# Altium project SOM Board with RK3399.PrjPcb (part 3 of 4)

## Sheet [12]-WIFI Module WF60.SchDoc: RK3399 SOM Board Design V1.0
size A4; Author: AVIRAL MISHRA; DocumentNumber: 14; SheetNumber: 14; SheetTotal: 21; PROJECT CODE: A_V1.0
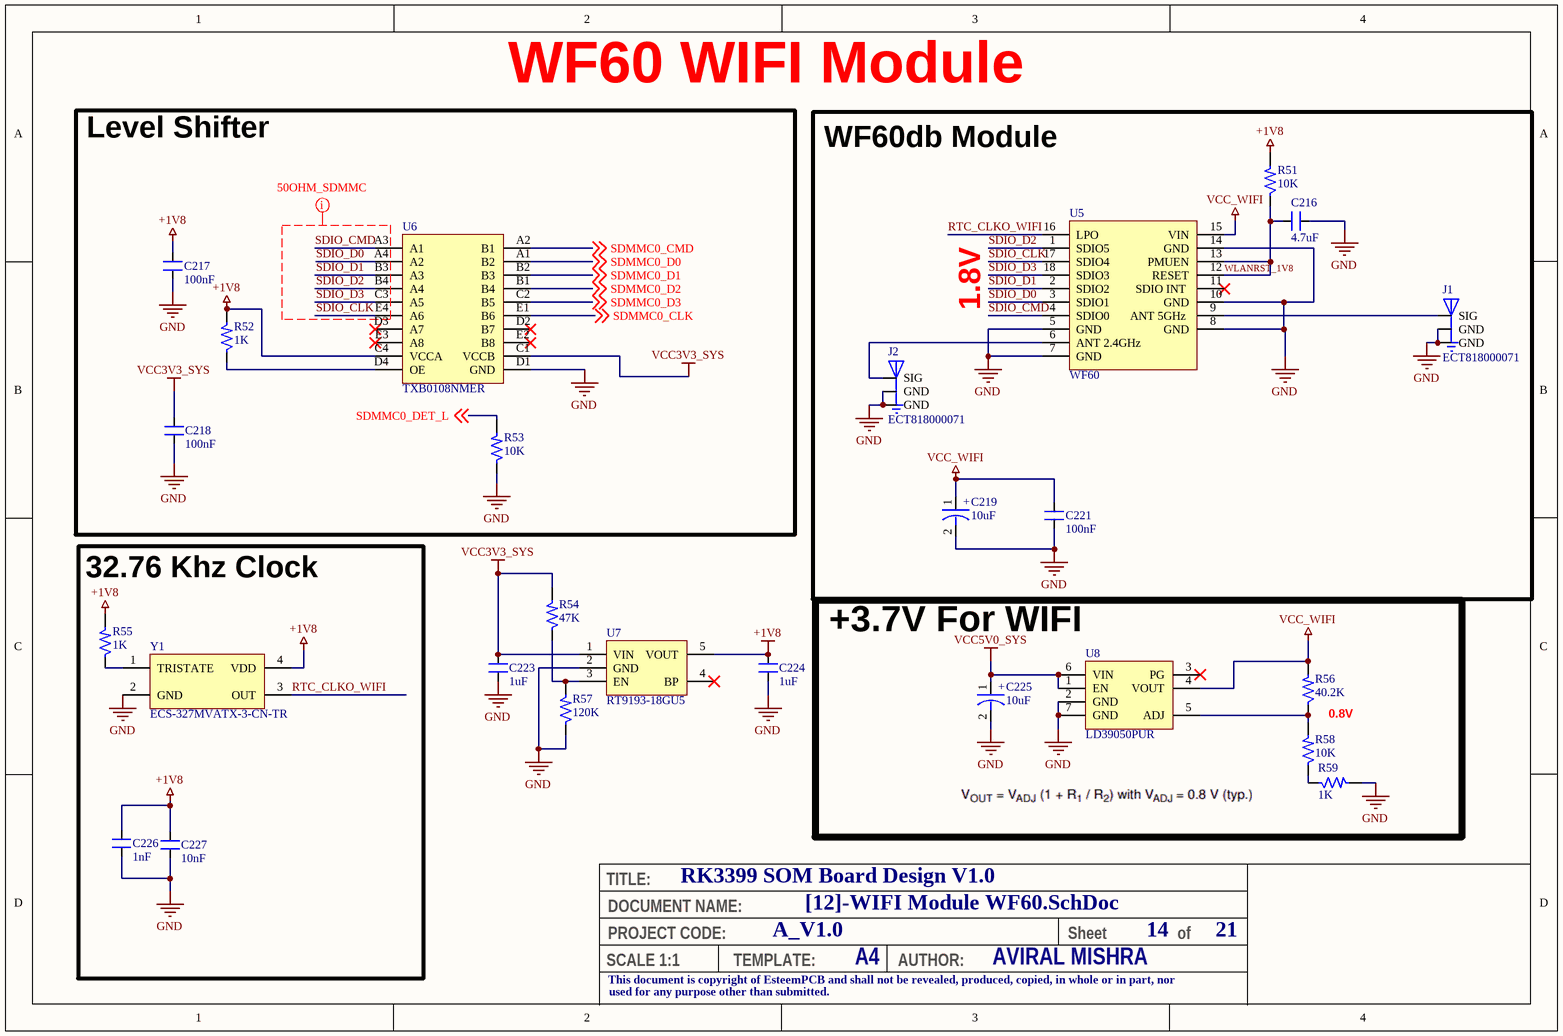
[diagram p13: [12]-WIFI Module WF60.SchDoc]

### Parts
C216  4.7uF  [CAP_0402]
C217  100nF  [CAP_0402]
C218  100nF  [CAP_0402]
C219  10uF  [CAP-T_1206]
C221  100nF  [CAP_0402]
C223  1uF  [CAP_0402]
C224  1uF  [CAP_0402]
C225  10uF  [CAP-T_1206]
C226  1nF  [CAP_0402]
C227  10nF  [CAP_0402]
J1  ECT818000071  [CON3_UFL_116_SMD_ST]
J2  ECT818000071  [CON3_UFL_116_SMD_ST]
R51  10K  [RES_0402]
R52  1K  [RES_0402]
R53  10K  [RES_0201]
R54  47K  [RES_0402]
R55  1K  [RES_0402]
R56  40.2K  [RES_0805]
R57  120K  [RES_0402]
R58  10K  [RES_0402]
R59  1K  [RES_0402]
U5  WF60  [MOD_WF60]
U6  TXB0108NMER  [NFBGA_31.4_125.9X102.36]
U7  RT9193-18GU5  [SC70-5]
U8  LD39050PUR  [DFN-6_37.4_165_33X15_SMD]
Y1  ECS-327MVATX-3-CN-TR  [XTAL_57_35X31_SMD]

### Blocks framed on the sheet
WF60 WIFI Module: C217 C218 R52 R53 U6
32.76 Khz Clock: C226 C227 R55 Y1
+3.7V For WIFI: C225 R56 R58 R59 U8

### Nets
+1V8: C217.2 C224.2 C226.2 C227.2 R51.2 R52.2 R55.2 U6.C4(VCCA) U7.5(VOUT) Y1.4(VDD)
GND: C216.1 C217.1 C218.1 C219.2 C221.1 C223.1 C224.1 C225.2 C226.1 C227.1 J1.1(GND) J1.3(GND) J2.1(GND) J2.3(GND) R53.1 R57.1 R59.2 U5.5(GND) U5.7(GND) U5.8(GND) U5.10(GND) U5.14(GND) U6.D1(GND) U7.2(GND) U8.2(GND) U8.7(GND) Y1.2(GND)
VCC3V3_SYS: C218.2 C223.2 R54.2 U6.C1(VCCB) U7.1(VIN)
VCC5V0_SYS: C225.1 U8.1(EN) U8.6(VIN)
VCC_WIFI: C219.1 C221.2 R56.2 U5.15(VIN) U8.4(VOUT)
RTC_CLKO_WIFI: U5.16(LPO) Y1.3(OUT)
SDIO_CLK: U5.17(SDIO4) U6.E4(A6)
SDIO_CMD: U5.4(SDIO0) U6.A3(A1)
SDIO_D0: U5.3(SDIO1) U6.A4(A2)
SDIO_D1: U5.2(SDIO2) U6.B3(A3)
SDIO_D2: U5.1(SDIO5) U6.B4(A4)
SDIO_D3: U5.18(SDIO3) U6.C3(A5)
SDMMC0_CLK: U6.E1(B6) ; off-sheet SDMMC0_CLK
SDMMC0_CMD: U6.A2(B1) ; off-sheet SDMMC0_CMD
SDMMC0_D0: U6.A1(B2) ; off-sheet SDMMC0_D0
SDMMC0_D1: U6.B2(B3) ; off-sheet SDMMC0_D1
SDMMC0_D2: U6.B1(B4) ; off-sheet SDMMC0_D2
SDMMC0_D3: U6.C2(B5) ; off-sheet SDMMC0_D3
SDMMC0_DET_L: R53.2 ; off-sheet SDMMC0_DET_L
WLANRST_1V8: C216.2 R51.1 U5.12(RESET) U5.13(PMUEN)
NetJ1_2: J1.2(SIG) U5.9(ANT_5GHz)
NetJ2_2: J2.2(SIG) U5.6(ANT_2.4GHz)
NetR52_1: R52.1 U6.D4(OE)
NetR54_1: R54.1 R57.2 U7.3(EN)
NetR55_1: R55.1 Y1.1(TRISTATE)
NetR56_1: R56.1 R58.2 U8.5(ADJ)
NetR58_1: R58.1 R59.1

Not connected (* = marked no-connect by the designer): U5 11(SDIO_INT_)*; U6 D2(B7)* D3(A7)* E2(B8)* E3(A8)*; U7 4(BP)*; U8 3(PG)*

### Layout directives
net class 50OHM_SDMMC: SDIO_CLK, SDIO_CMD, SDIO_D0, SDIO_D1, SDIO_D2, SDIO_D3

### Notes on the sheet
- Level Shifter
- WF60db Module
- 1.8V
- 0.8V
- TITLE:
- DOCUMENT NAME:
- SCALE 1:1
- This document is copyright of EsteemPCB and shall not be revealed, produced, copied, in whole or in part, nor
- PROJECT CODE:
- TEMPLATE:
- A4
- AUTHOR:
- Sheet
- of
- used for any purpose other than submitted.
- (in symbol CAP-P_10uF-16V-10%-1206) +

### Library data of the parts
C216 = CAP_4.7uF-10V-10%-0402: 4.7µF ±10% 10V Ceramic Capacitor X5R 0402 (1005 Metric) /; Manufacturer: Samsung Electro-Mechanics; Manufacturer Part Number: CL05A475KP5NRNC; Case/Package: 0402; Supplier-1: Digikey
C217 C218 C221 = CAP_100nF-25V-10%-0402: 0.1µF ±10% 25V Ceramic Capacitor X7R 0402 (1005 Metric) /; Manufacturer: Walsin Technology Corporation; Manufacturer Part Number: 0402B104K250CT; Case/Package: 0402; Supplier-1: Digikey
C219 C225 = CAP-P_10uF-16V-10%-1206: 10µF Molded Tantalum Capacitors 16V 1206 (3216 Metric) 3Ohm /; Manufacturer: AVX Corporation; Manufacturer Part Number: TAJA106K016SNJ; Nymble Part Number: 1EA-AA-0003; Alternate Part Number-1: CA45-A016K106T; Case/Package: 1206; Supplier-1: SIRICOM; Supplier Part Number-1: TAJA106K016SNJ; Category: Capacitor; Number of Pins: 2
C223 C224 = CAP_1uF-16V-10%-0402: 1µF ±10% 16V Ceramic Capacitor X5R 0402 (1005 Metric) /; Manufacturer: Knowles Novacap; Manufacturer Part Number: 0402BW105K160YT; Case/Package: 0402; Supplier-1: Digikey
C226 = CAP_1nF-16V-10%-0402: 1000pF ±10% 16V Ceramic Capacitor X7R 0402 (1005 Metric) /; Manufacturer: Yageo; Manufacturer Part Number: CC0402KRX7R7BB102; Case/Package: 0402; Supplier-1: Digikey
C227 = CAP_10nF-10V-10%-0402: 10000pF ±10% 10V Ceramic Capacitor X7R 0402 (1005 Metric) /; Manufacturer: AVX Corporation; Manufacturer Part Number: 0402ZC103KAT2A; Case/Package: 0402; Supplier-1: Digikey
J1 J2 = CON-PLG_3X1-ECT818000071-ST-SMD: SMD RF Connectors/Coaxial Connectors RoHS; Manufacturer: ECT; Manufacturer Part Number: ECT818000071; Case/Package: SMD; Supplier-1: LCSC
R51 R58 = RES_10K-0.1W-1%-0402: 10 kOhms ±1% 0.1W, 1/10W Chip Resistor 0402 (1005 Metric) Anti-Sulfur Thin Film /; Manufacturer: Vishay Beyschlag/Draloric/BC Components; Manufacturer Part Number: MCS04020C1002FE000; Case/Package: 0402; Supplier-1: Digikey
R52 R55 R59 = RES_1K-0.1W-1%-0402: 1 kOhms ±1% 0.1W, 1/10W Chip Resistor 0402 (1005 Metric) Anti-Sulfur Thin Film /; Manufacturer: Vishay Beyschlag/Draloric/BC Components; Manufacturer Part Number: MCS04020C1001FE000; Case/Package: 0402; Supplier-1: Digikey
R53 = RES_10K-0.05W-1%-0201: 10 kOhms ±1% 0.05W, 1/20W Chip Resistor 0201 (0603 Metric) Thick Film /; Manufacturer: Stackpole Electronics Inc; Manufacturer Part Number: RMCF0201FT10K0; Case/Package: 0201; Supplier-1: Digikey
R54 = RES_47K-0.1W-1%-0402: 47 kOhms ±1% 0.1W, 1/10W Chip Resistor 0402 (1005 Metric) Automotive AEC-Q200 Thick Film /; Manufacturer: Panasonic Electronic Components; Manufacturer Part Number: ERJ-2RKF4702X; Case/Package: 0402; Supplier-1: Digikey
R56 = RES_40.2K-0.125W-1%-0805: 40.2 kOhms ±1% 0.125W, 1/8W Chip Resistor 0805 (2012 Metric) Automotive AEC-Q200 Thick Film /; Manufacturer: TE Connectivity; Manufacturer Part Number: RMCF0805FT40K2; Nymble Part Number: 1EA-AA-0396; Alternate Part Number-1: NA; Case/Package: 0805; Supplier-1: SIRICOM; Supplier Part Number-1: WR08X4022FTL; Category: Resistor; Number of Pins: 2
R57 = RES_120K-0.1W-1%-0402: 120 kOhms ±1% 0.1W, 1/10W Chip Resistor 0402 (1005 Metric) Anti-Sulfur Thin Film /; Manufacturer: Vishay Beyschlag/Draloric/BC Components; Manufacturer Part Number: MCS04020C1203FE000; Case/Package: 0402; Supplier-1: Digikey
U5 = MOD_WF60-SMD: Amp’ed RF Tech presents the WF60 WiFi dual / band module: 802.11abgn.; Nymble Part Number: 1EA-AA-0568; Alternate Part Number-1: NA; Manufacturer: Amp’ed; Manufacturer Part Number: WF60; Case/Package: SMD; Supplier-1: Arrow; Supplier Part Number-1: WF60; Category: Module; Number of Pins: 16
U6 = IC_TXB0108NMER: Translation - Voltage Levels 8-Bit Bidirectional Voltage-Level Shifter with Auto Direction Sensing and +/-15-kV ESD Protect; Manufacturer: Texas Instruments; Manufacturer Part Number: TXB0108NMER; Case/Package: NFBGA-20; Supplier-1: Mouser
U7 = REG_1.8V-300mA-5.5V-SC70-5: Linear Voltage Regulator IC 1 Output 300mA SC-70-5; Manufacturer: Richtek USA Inc.; Manufacturer Part Number: RT9193-18GU5; Case/Package: SC70-5; Supplier-1: Digikey
U8 = REG_5.5V-0~5.1V-0.5A-2.55W-DFN-6: Adjustable 5.5V 0.8V 500mA DFN-6 Linear Voltage Regulators RoHS; Manufacturer: STMicroelectronics; Nymble Part Number: 1EA-AA-0572; Alternate Part Number-1: NA; Manufacturer Part Number: LD39050PUR; Case/Package: DFN-6; Supplier-1: LCSC; Supplier Part Number-1: C222094; Category: Regulators; Number of Pins: 6
Y1 = XTAL_ECS-327MVATX-2-CN-TR: 32.768kHz XO (Standard) CMOS Oscillator 1.6V ~ 3.6V Enable/Disable 4-SMD, No Lead; Manufacturer: ECS INC; Nymble Part Number: 1EA-AA-0561; Alternate Part Number-1: NA; Manufacturer Part Number: ECS-327MVATX-3-CN-TR; Case/Package: SMD-4; Supplier-1: Digikey; Supplier Part Number-1: ECS-327MVATX-3-CN-TR; Category: Crystal; Number of Pins: 4

## Sheet [13]-TYPEC0_PROG.SchDoc: RK3399 SOM Board Design V1.0
size A3; Author: ABC; Organization: Altium Limited; Address1: L3, 12a Rodborough Rd; Address2: Frenchs Forest; Address3: NSW; Address4: Australia 2086; DocumentNumber: 15; SheetNumber: 15; SheetTotal: 21; PROJECT CODE: A_V1.0
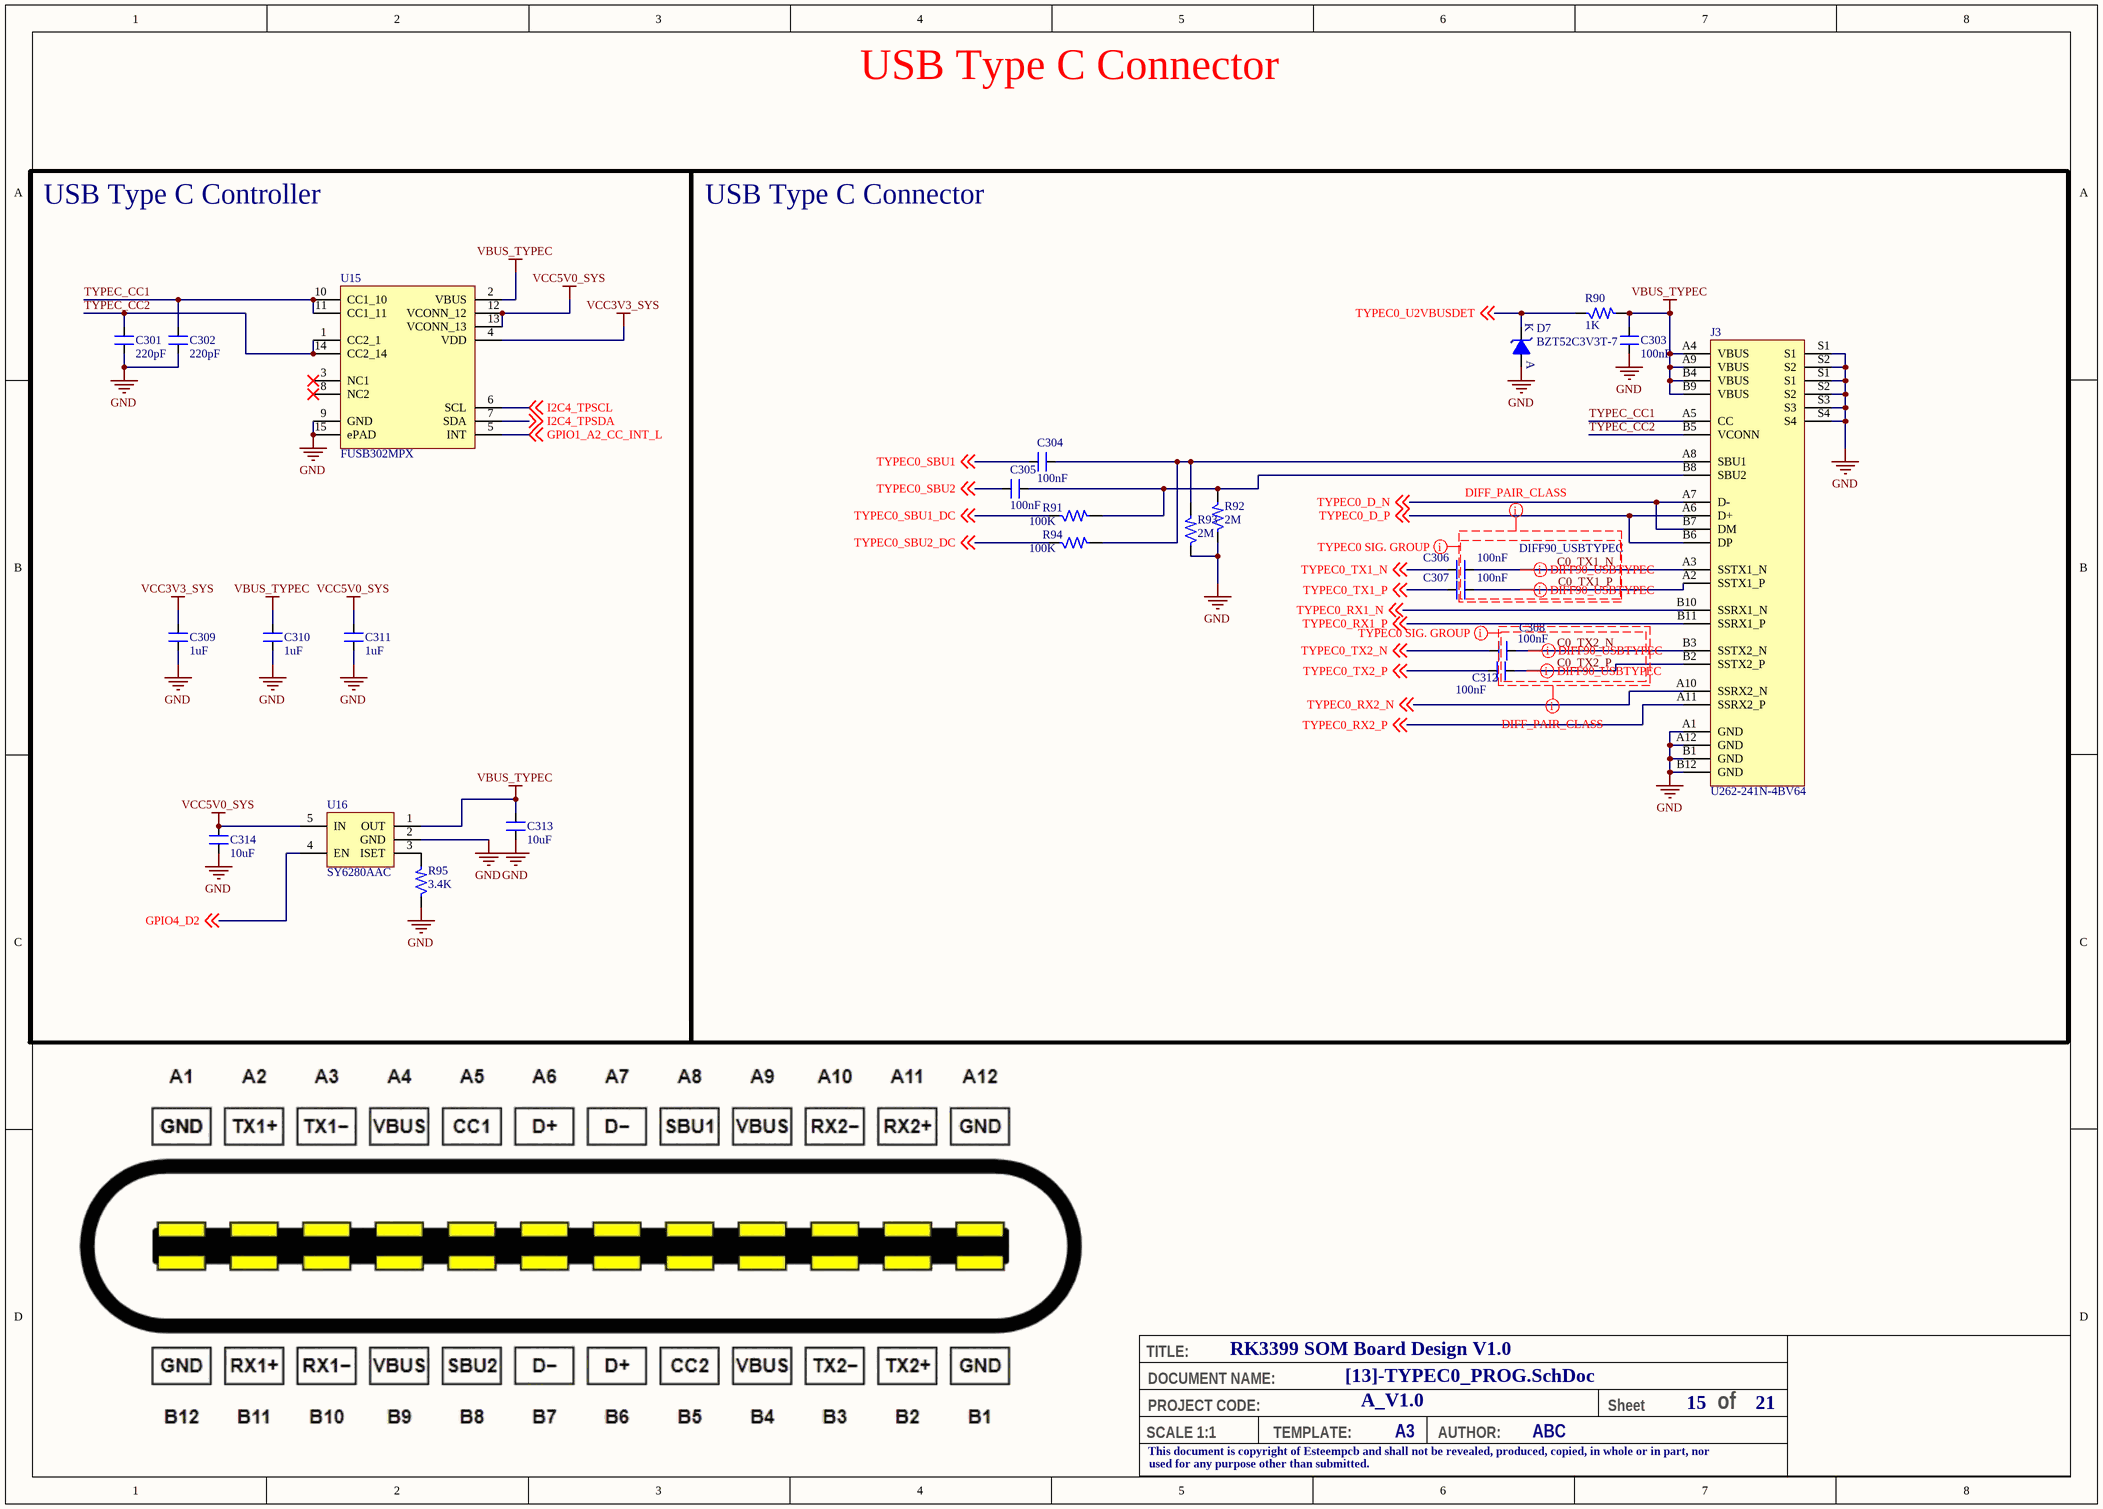
[diagram p14: [13]-TYPEC0_PROG.SchDoc]

### Parts
C301  220pF  [CAP_0402]
C302  220pF  [CAP_0402]
C303  100nF  [CAP_0603]
C304  100nF  [CAP_0402]
C305  100nF  [CAP_0402]
C306  100nF  [CAP_0402]
C307  100nF  [CAP_0402]
C308  100nF  [CAP_0402]
C309  1uF  [CAP_0402]
C310  1uF  [CAP_0402]
C311  1uF  [CAP_0402]
C312  100nF  [CAP_0402]
C313  10uF  [CAP_0402]
C314  10uF  [CAP_0402]
D7  BZT52C3V3T-7  [DIO_SOD523]
J3  U262-241N-4BV64  [CON24_19.64_U262-241N-4BV64_TH_RA]
R90  1K  [RES_0402]
R91  100K  [RES_0402]
R92  2M  [RES_0402]
R93  2M  [RES_0402]
R94  100K  [RES_0402]
R95  3.4K  [RES_0402]
U15  FUSB302MPX  [MLP-14_98.4X98.4_SMD]
U16  SY6280AAC  [SOT23-5]

### Blocks framed on the sheet
USB Type C Controller: C301 C302 C309-C311 C313 C314 R95 U15 U16
USB Type C Connector: C303-C308 C312 D7 J3 R90-R94

### Nets
GND: C301.1 C302.1 C303.1 C309.1 C310.1 C311.1 C313.1 C314.1 D7.A J3.A1(GND) J3.A12(GND) J3.B1(GND) J3.B12(GND) J3.S1 J3.S2 J3.S3 J3.S4 R92.1 R93.1 R95.1 U15.9(GND) U15.15(ePAD) U16.2(GND)
VBUS_TYPEC: C303.2 C310.2 C313.2 J3.A4(VBUS) J3.A9(VBUS) J3.B4(VBUS) J3.B9(VBUS) R90.2 U15.2(VBUS) U16.1(OUT)
VCC3V3_SYS: C309.2 U15.4(VDD)
VCC5V0_SYS: C311.2 C314.2 U15.12(VCONN_12) U15.13(VCONN_13) U16.5(IN)
C0_TX1_N: C306.2 J3.A3(SSTX1_N)
C0_TX1_P: C307.2 J3.A2(SSTX1_P)
C0_TX2_N: C308.2 J3.B3(SSTX2_N)
C0_TX2_P: C312.2 J3.B2(SSTX2_P)
GPIO1_A2_CC_INT_L: U15.5(INT) ; off-sheet GPIO1_A2_CC_INT_L
GPIO4_D2: U16.4(EN) ; off-sheet GPIO4_D2
I2C4_TPSCL: U15.6(SCL) ; off-sheet I2C4_TPSCL
I2C4_TPSDA: U15.7(SDA) ; off-sheet I2C4_TPSDA
TYPEC0_D_N: J3.A7(D-) J3.B7(DM) ; off-sheet TYPEC0_D_N
TYPEC0_D_P: J3.A6(D+) J3.B6(DP) ; off-sheet TYPEC0_D_P
TYPEC0_RX1_N: J3.B10(SSRX1_N) ; off-sheet TYPEC0_RX1_N
TYPEC0_RX1_P: J3.B11(SSRX1_P) ; off-sheet TYPEC0_RX1_P
TYPEC0_RX2_N: J3.A10(SSRX2_N) ; off-sheet TYPEC0_RX2_N
TYPEC0_RX2_P: J3.A11(SSRX2_P) ; off-sheet TYPEC0_RX2_P
TYPEC0_SBU1: C304.1 ; off-sheet TYPEC0_SBU1
TYPEC0_SBU1_DC: R91.1 ; off-sheet TYPEC0_SBU1_DC
TYPEC0_SBU2: C305.1 ; off-sheet TYPEC0_SBU2
TYPEC0_SBU2_DC: R94.1 ; off-sheet TYPEC0_SBU2_DC
TYPEC0_TX1_N: C306.1 ; off-sheet TYPEC0_TX1_N
TYPEC0_TX1_P: C307.1 ; off-sheet TYPEC0_TX1_P
TYPEC0_TX2_N: C308.1 ; off-sheet TYPEC0_TX2_N
TYPEC0_TX2_P: C312.1 ; off-sheet TYPEC0_TX2_P
TYPEC0_U2VBUSDET: D7.K R90.1 ; off-sheet TYPEC0_U2VBUSDET
TYPEC_CC1: C302.2 J3.A5(CC) U15.10(CC1_10) U15.11(CC1_11)
TYPEC_CC2: C301.2 J3.B5(VCONN) U15.1(CC2_1) U15.14(CC2_14)
NetC304_2: C304.2 J3.A8(SBU1) R93.2 R94.2
NetC305_2: C305.2 J3.B8(SBU2) R91.2 R92.2
NetR95_2: R95.2 U16.3(ISET)

Not connected (* = marked no-connect by the designer): U15 3(NC1)* 8(NC2)*

### Layout directives
net class TYPEC0 SIG. GROUP: C0_TX1_N, C0_TX1_P, C0_TX2_N, C0_TX2_P
differential pair; differential pair class DIFF90_USBTYPEC: C0_TX1_N, C0_TX1_P, C0_TX2_N, C0_TX2_P
net class DIFF_PAIR_CLASS: C0_TX1_N, C0_TX1_P, C0_TX2_N, C0_TX2_P

### Notes on the sheet
- USB Type C Connector
- TITLE:
- DOCUMENT NAME:
- SCALE 1:1
- This document is copyright of Esteempcb and shall not be revealed, produced, copied, in whole or in part, nor
- PROJECT CODE:
- TEMPLATE:
- A3
- AUTHOR:
- Sheet
- of
- used for any purpose other than submitted.

### Library data of the parts
C301 C302 = CAP_220pF-10V-10%-0402: 220pF ±10% 10V Ceramic Capacitor X7R 0402 (1005 Metric) /; Manufacturer: KEMET; Manufacturer Part Number: C0402C221K8RAC7867; Case/Package: 0402; Supplier-1: Digikey
C303 = CAP_100nF-10V-5%-0603: 0.1µF ±10% 10V Ceramic Capacitor X7R 0603 (1608 Metric) /; Manufacturer: Yageo; Manufacturer Part Number: CC0603KRX7R6BB104; Case/Package: 0603; Supplier-1: Digikey
C304-C308 C312 = CAP_100nF-25V-10%-0402: as C217 on sheet [12]-WIFI Module WF60; Case/Package: 0402; Supplier-1: Digikey
C309-C311 = CAP_1uF-10V-10%-0402: 1µF ±10% 10V Ceramic Capacitor X6S 0402 (1005 Metric) /; Manufacturer: Murata Electronics; Manufacturer Part Number: GRT155C81A105KE01D; Case/Package: 0402; Supplier-1: Digikey
C313 C314 = CAP_10uF-10V-20%-0402: as C101 on sheet [8]-RK3399 SDRAM Page; Case/Package: 0402; Supplier-1: Digikey
D7 = DIO-Z_3.3V-300mW-SOD-523: Zener Diode 3.3V 300mW ±6% Surface Mount SOD-523 /; Manufacturer: Diodes Incorporated; Manufacturer Part Number: BZT52C3V3T-7; Case/Package: SOD523; Supplier-1: Digikey
J3 = CON-TYPEC_U262-241N-4BV64-SMD: USB - Type C Female 24 SMD USB Connectors RoHS; Manufacturer: XKB Connectivity; Manufacturer Part Number: U262-241N-4BV64; Case/Package: SMD; Supplier-1: LCSC
R90 = RES_1K-0.1W-1%-0402: as R52 on sheet [12]-WIFI Module WF60; Case/Package: 0402; Supplier-1: Digikey
R91 R94 = RES_100K-0.1W-1%-0402: 100 kOhms ±1% 0.1W, 1/10W Chip Resistor 0402 (1005 Metric) Anti-Sulfur Thin Film /; Manufacturer: Vishay Beyschlag/Draloric/BC Components; Manufacturer Part Number: MCS04020C1003FE000; Case/Package: 0402; Supplier-1: Digikey
R92 R93 = RES_2M-0.1W-1%-0402: 2 MOhms ±1% 0.1W, 1/10W Chip Resistor 0402 (1005 Metric) Anti-Sulfur Thin Film /; Manufacturer: Vishay Beyschlag/Draloric/BC Components; Manufacturer Part Number: MCS04020C2004FE000; Case/Package: 0402; Supplier-1: Digikey
R95 = RES_3.4K-0.1W-1%-0402: 3.4 kOhms ±1% 0.1W, 1/10W Chip Resistor 0402 (1005 Metric) Automotive AEC-Q200 Thick Film /; Manufacturer: Panasonic Electronic Components; Manufacturer Part Number: ERJ-2RKF3401X; Case/Package: 0402; Supplier-1: Digikey
U15 = IC_FUSB302MPX: USB Controller USB 3.1 USB Interface 14-MLP (2.5x2.5); Manufacturer: ON Semiconductor; Manufacturer Part Number: FUSB302MPX; Case/Package: 14-MLP; Supplier-1: Digikey
U16 = REG-ADJ_5.5V-5.5V-1.25A-SOT-23-5: SOT-23-5 PMIC - Power Distribution Switches RoHS; Manufacturer: Silergy Corp; Manufacturer Part Number: SY6280AAC; Case/Package: SOT-23-5; Supplier-1: LCSC

## Sheet [14]-RGMII_PHY.SchDoc: RK3399 SOM Board Design V1.0
size A3; Author: ABC; Organization: Altium Limited; Address1: L3, 12a Rodborough Rd; Address2: Frenchs Forest; Address3: NSW; Address4: Australia 2086; DocumentNumber: 16; SheetNumber: 16; SheetTotal: 21; PROJECT CODE: A_V1.0
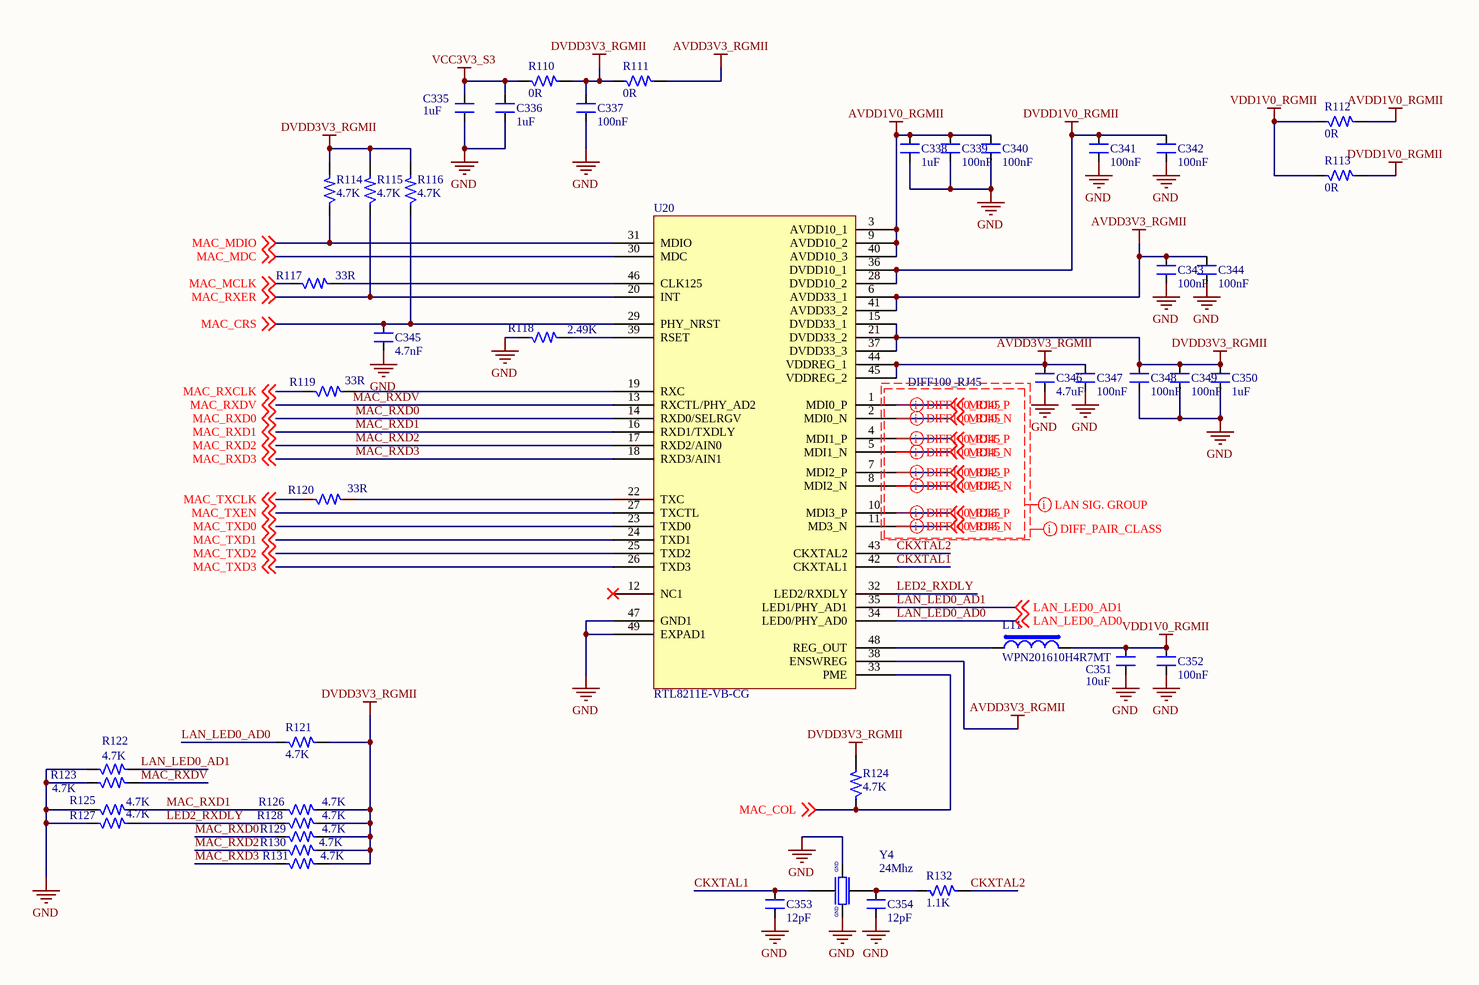
[diagram p15: [14]-RGMII_PHY.SchDoc]

### Parts
C335  1uF  [CAP_0201]
C336  1uF  [CAP_0201]
C337  100nF  [CAP_0201]
C338  1uF  [CAP_0201]
C339  100nF  [CAP_0201]
C340  100nF  [CAP_0201]
C341  100nF  [CAP_0201]
C342  100nF  [CAP_0201]
C343  100nF  [CAP_0201]
C344  100nF  [CAP_0201]
C345  4.7nF  [CAP_0201]
C346  4.7uF  [CAP_0201]
C347  100nF  [CAP_0201]
C348  100nF  [CAP_0201]
C349  100nF  [CAP_0201]
C350  1uF  [CAP_0603]
C351  10uF  [CAP_0402]
C352  100nF  [CAP_0201]
C353  12pF  [CAP_0201]
C354  12pF  [CAP_0201]
L11  WPN201610H4R7MT  [IND_62.9_110X86.6_SMD]
R110  0R  [RES_0201]
R111  0R  [RES_0201]
R112  0R  [RES_0201]
R113  0R  [RES_0201]
R114  4.7K  [RES_0201]
R115  4.7K  [RES_0201]
R116  4.7K  [RES_0201]
R117  33R  [RES_0201]
R118  2.49K  [RES_0201]
R119  33R  [RES_0201]
R120  33R  [RES_0201]
R121  4.7K  [RES_0201]
R122  4.7K  [RES_0201]
R123  4.7K  [RES_0201]
R124  4.7K  [RES_0201]
R125  4.7K  [RES_0201]
R126  4.7K  [RES_0201]
R127  4.7K  [RES_0201]
R128  4.7K  [RES_0201]
R129  4.7K  [RES_0201]
R130  4.7K  [RES_0201]
R131  4.7K  [RES_0201]
R132  1.1K  [RES_0201]
U20  RTL8211E-VB-CG  [QFN48_19.6_324X324_SMD]
Y4  24Mhz  [XTAL_ABM8AIG-24.000MHZ-12-2Z-T3]

### Nets
AVDD1V0_RGMII: C338.2 C339.2 C340.2 R112.2 U20.3(AVDD10_1) U20.9(AVDD10_2) U20.40(AVDD10_3)
AVDD3V3_RGMII: C343.2 C344.2 C346.2 C347.2 R111.2 U20.6(AVDD33_1) U20.38(ENSWREG) U20.41(AVDD33_2) U20.44(VDDREG_1) U20.45(VDDREG_2)
DVDD1V0_RGMII: C341.2 C342.2 R113.2 U20.28(DVDD10_2) U20.36(DVDD10_1)
DVDD3V3_RGMII: C337.2 C348.2 C349.2 C350.2 R110.2 R111.1 R114.2 R115.2 R116.2 R121.2 R124.2 R126.2 R128.2 R129.2 R130.2 R131.2 U20.15(DVDD33_1) U20.21(DVDD33_2) U20.37(DVDD33_3)
GND: C335.1 C336.1 C337.1 C338.1 C339.1 C340.1 C341.1 C342.1 C343.1 C344.1 C345.1 C346.1 C347.1 C348.1 C349.1 C350.1 C351.1 C352.1 C353.1 C354.1 R118.1 R122.1 R123.1 R125.1 R127.1 U20.47(GND1) U20.49(EXPAD1) Y4.2 Y4.4
VCC3V3_S3: C335.2 C336.2 R110.1
VDD1V0_RGMII: C351.2 C352.2 L11.2 R112.1 R113.1
CKXTAL1: C353.2 U20.42(CKXTAL1) Y4.1
CKXTAL2: R132.2 U20.43(CKXTAL2)
LAN_LED0_AD0: R121.1 U20.34(LED0/PHY_AD0) ; off-sheet LAN_LED0_AD0
LAN_LED0_AD1: R122.2 U20.35(LED1/PHY_AD1) ; off-sheet LAN_LED0_AD1
LED2_RXDLY: R127.2 R128.1 U20.32(LED2/RXDLY)
MAC_COL: R124.1 U20.33(PME) ; off-sheet MAC_COL
MAC_CRS: C345.2 R116.1 U20.29(PHY_NRST) ; off-sheet MAC_CRS
MAC_MCLK: R117.1 ; off-sheet MAC_MCLK
MAC_MDC: U20.30(MDC) ; off-sheet MAC_MDC
MAC_MDIO: R114.1 U20.31(MDIO) ; off-sheet MAC_MDIO
MAC_RXCLK: R119.1 ; off-sheet MAC_RXCLK
MAC_RXD0: R129.1 U20.14(RXD0/SELRGV) ; off-sheet MAC_RXD0
MAC_RXD1: R125.2 R126.1 U20.16(RXD1/TXDLY) ; off-sheet MAC_RXD1
MAC_RXD2: R130.1 U20.17(RXD2/AIN0) ; off-sheet MAC_RXD2
MAC_RXD3: R131.1 U20.18(RXD3/AIN1) ; off-sheet MAC_RXD3
MAC_RXDV: R123.2 U20.13(RXCTL/PHY_AD2) ; off-sheet MAC_RXDV
MAC_RXER: R115.1 U20.20(INT) ; off-sheet MAC_RXER
MAC_TXCLK: R120.1 ; off-sheet MAC_TXCLK
MAC_TXD0: U20.23(TXD0) ; off-sheet MAC_TXD0
MAC_TXD1: U20.24(TXD1) ; off-sheet MAC_TXD1
MAC_TXD2: U20.25(TXD2) ; off-sheet MAC_TXD2
MAC_TXD3: U20.26(TXD3) ; off-sheet MAC_TXD3
MAC_TXEN: U20.27(TXCTL) ; off-sheet MAC_TXEN
MDI0_N: U20.2(MDI0_N) ; off-sheet MDI0_N
MDI0_P: U20.1(MDI0_P) ; off-sheet MDI0_P
MDI1_N: U20.5(MDI1_N) ; off-sheet MDI1_N
MDI1_P: U20.4(MDI1_P) ; off-sheet MDI1_P
MDI2_N: U20.8(MDI2_N) ; off-sheet MDI2_N
MDI2_P: U20.7(MDI2_P) ; off-sheet MDI2_P
MDI3_N: U20.11(MD3_N) ; off-sheet MDI3_N
MDI3_P: U20.10(MDI3_P) ; off-sheet MDI3_P
NetC354_2: C354.2 R132.1 Y4.3
NetL11_1: L11.1 U20.48(REG_OUT)
NetR117_2: R117.2 U20.46(CLK125)
NetR118_2: R118.2 U20.39(RSET)
NetR119_2: R119.2 U20.19(RXC)
NetR120_2: R120.2 U20.22(TXC)

Not connected (* = marked no-connect by the designer): U20 12(NC1)*

### Layout directives
differential pair; differential pair class DIFF100_RJ45: MDI0_N, MDI0_P, MDI1_N, MDI1_P, MDI2_N, MDI2_P, MDI3_N, MDI3_P
net class LAN SIG. GROUP: MDI0_N, MDI0_P, MDI1_N, MDI1_P, MDI2_N, MDI2_P, MDI3_N, MDI3_P
net class DIFF_PAIR_CLASS: MDI0_N, MDI0_P, MDI1_N, MDI1_P, MDI2_N, MDI2_P, MDI3_N, MDI3_P

### Notes on the sheet
- TITLE:
- DOCUMENT NAME:
- SCALE 1:1
- This document is copyright of Esteempcb and shall not be revealed, produced, copied, in whole or in part, nor
- PROJECT CODE:
- TEMPLATE:
- A3
- AUTHOR:
- Sheet
- of
- used for any purpose other than submitted.
- (in symbol XTAL_24Mhz-12pF-4-SMD) GND

### Library data of the parts
C335 C336 C338 = CAP_1uF-16V-10%-0201: 1µF ±20% 16V Ceramic Capacitor X5R 0201 (0603 Metric) /; Manufacturer: Samsung Electro-Mechanics; Manufacturer Part Number: CL03A105MO3NRNH; Case/Package: 0201; Supplier-1: Digikey
C337 C339-C344 C347-C349 C352 = CAP_100nF-25V-10%-0201: 0.1µF ±10% 25V Ceramic Capacitor X5R 0201 (0603 Metric) /; Manufacturer: TDK Corporation; Manufacturer Part Number: C0603X5R1E104K030BB; Case/Package: 0201; Supplier-1: Digikey
C345 = CAP_4.7nF-10V-10%-0201: 4700pF ±10% 10V Ceramic Capacitor X7R 0201 (0603 Metric) /; Manufacturer: AVX Corporation; Manufacturer Part Number: 0201ZC472KAT2A; Case/Package: 0201; Supplier-1: Digikey
C346 = CAP_4.7uF-6.3V-20%-0201: 4.7µF ±20% 6.3V Ceramic Capacitor X5R 0201 (0603 Metric) /; Manufacturer: Murata Electronics; Manufacturer Part Number: GRM035R60J475ME15D; Case/Package: 0201; Supplier-1: Digikey
C350 = CAP_1uF-10V-5%-0603: 1µF ±10% 10V Ceramic Capacitor X5R 0603 (1608 Metric) /; Manufacturer: Samsung Electro-Mechanics; Manufacturer Part Number: CL10A105KP8NNNC; Case/Package: 0603; Supplier-1: Digikey
C351 = CAP_10uF-10V-20%-0402: 10µF ±20% 10V Ceramic Capacitor X5R 0402 (1005 Metric) /; Manufacturer Part Number: CL05A106MP5NUNC; Manufacturer: Samsung Electro-Mechanics; Case/Package: 0402; Supplier-1: Digikey
C353 C354 = CAP_12pF-16V-10%-0201: 12pF ±10% 16V Ceramic Capacitor C0G, NP0 0201 (0603 Metric) /; Manufacturer: AVX Corporation; Manufacturer Part Number: 0201YA120KAT2A; Case/Package: 0201; Supplier-1: Digikey
L11 = IND_4.7uH-0.9A-20%-SMD: 4.7uH ±20% 900mA 425mΩ SMD,2.0x1.6x1.0mm Power Inductors RoHS /; Manufacturer: Sunlord; Manufacturer Part Number: WPN201610H4R7MT; Case/Package: SMD; Supplier-1: LCSC
R110-R113 = RES_0R-0.05W-1%-0201: 0 Ohms Jumper 0.05W, 1/20W Chip Resistor 0201 (0603 Metric) Automotive AEC-Q200 Thick Film; Manufacturer: Bourns Inc.; Manufacturer Part Number: CR0201AJ/-000GLF; Case/Package: 0201; Supplier-1: Digikey
R114-R116 R121-R131 = RES_4.7K-0.1W-1%-0201: 4.02 kOhms ±1% 0.05W, 1/20W Chip Resistor 0201 (0603 Metric) Thick Film /; Manufacturer: Yageo; Manufacturer Part Number: RC0201FR-074K02L; Case/Package: 0201; Supplier-1: Digikey
R117 R119 R120 = RES_33R-0.05W-1%-0201: 33 Ohms ±1% 0.05W, 1/20W Chip Resistor 0201 (0603 Metric) Thick Film /; Manufacturer: Yageo; Manufacturer Part Number: RC0201FR-0733RL; Case/Package: 0201; Supplier-1: Digikey
R118 = RES_2.49K-0.05W-1%-0201: 2.49 kOhms ±1% 0.05W, 1/20W Chip Resistor 0201 (0603 Metric) Automotive AEC-Q200 Thick Film /; Manufacturer: Panasonic Electronic Components; Manufacturer Part Number: ERJ-1GNF2491C; Case/Package: 0201; Supplier-1: Digikey
R132 = RES_1.1K-0.05W-1%-0201: 1.1 kOhms ±1% 0.05W, 1/20W Chip Resistor 0201 (0603 Metric) Automotive AEC-Q200 Thick Film /; Manufacturer: Panasonic Electronic Components; Manufacturer Part Number: ERJ-1GNF1101C; Case/Package: 0201; Supplier-1: Digikey
U20 = IC_RTL8211E-VB-CG: Ethernet Transceivers 10/100/1000 Base-T PHY GMII, MII, RGMII 1.43V ~ 3.63V QFN-48_6x6x04P Ethernet ICs RoHS; Manufacturer: Realtek Semicon; Manufacturer Part Number: RTL8211E-VB-CG; Case/Package: QFN-48; Supplier-1: LCSC
Y4 = XTAL_24Mhz-12pF-4-SMD: 24MHz ±20ppm Crystal 12pF 50 Ohms 4-SMD, No Lead /; Manufacturer: Abracon LLC; Manufacturer Part Number: ABM8AIG-24.000MHZ-12-2Z-T3; Case/Package: SMD; Supplier-1: Digikey

## Sheet [15]-Push_Button_&_SYS_LED.SchDoc: RK3399 SOM Board Design V1.0
size A4; Author: AVIRAL MISHRA; DocumentNumber: 17; SheetNumber: 17; SheetTotal: 21; PROJECT CODE: A_V1.0
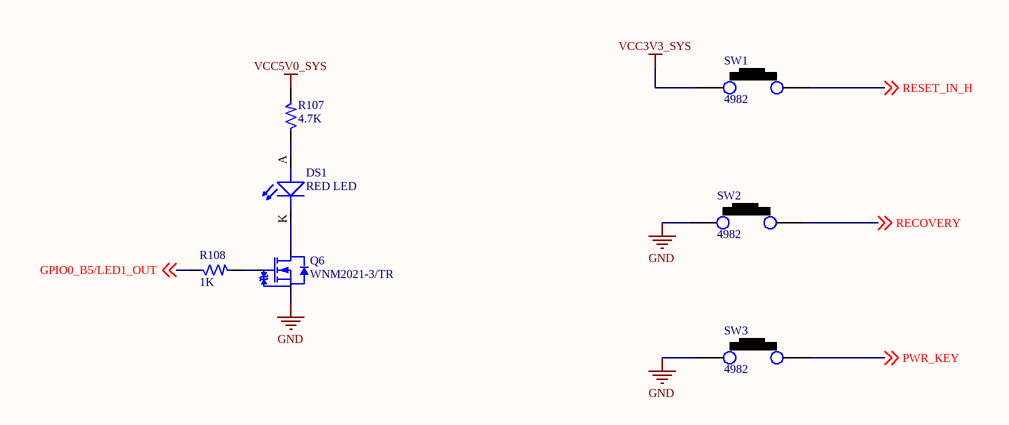
[diagram p16: [15]-Push_Button_&_SYS_LED.SchDoc]

### Parts
DS1  RED LED  [LED_0805]
Q6  WNM2021-3/TR  [SOT-323-3]
R107  4.7K  [RES_0402]
R108  1K  [RES_0402]
SW1  4982  [SW_177_39.3X77.7_SMD]
SW2  4982  [SW_177_39.3X77.7_SMD]
SW3  4982  [SW_177_39.3X77.7_SMD]

### Nets
GND: Q6.2(S) SW2.1 SW3.1
VCC3V3_SYS: SW1.1
VCC5V0_SYS: R107.2
GPIO0_B5/LED1_OUT: R108.1 ; off-sheet GPIO0_B5/LED1_OUT
PWR_KEY: SW3.2 ; off-sheet PWR_KEY
RECOVERY: SW2.2 ; off-sheet RECOVERY
RESET_IN_H: SW1.2 ; off-sheet RESET_IN_H
NetDS1_A: DS1.A(ANODE) R107.1
NetDS1_K: DS1.K(CATHODE) Q6.3(D)
NetQ6_1: Q6.1(G) R108.2

### Notes on the sheet
- TITLE:
- DOCUMENT NAME:
- SCALE 1:1
- This document is copyright of EsteemPCB and shall not be revealed, produced, copied, in whole or in part, nor
- PROJECT CODE:
- TEMPLATE:
- A4
- AUTHOR:
- Sheet
- of
- used for any purpose other than submitted.

### Library data of the parts
DS1 = LED_RED-2V-20mA-0805: Red 631nm LED Indication - Discrete 2V 0805 (2012 Metric); Manufacturer: Vishay Lite-On; Manufacturer Part Number: LTST-C171KRKT; Case/Package: 0805; Supplier-1: SP ROAD
Q6 = MOSFET-N_20V-820mA-SOT-323: N Channel 20V 820mA 850mV @ 250uA 310mΩ @ 550mA,4.5V 310mW SOT-323(SC-70) MOSFET RoHS /; Manufacturer: WILLSEMI(Will Semicon); Manufacturer Part Number: WNM2021-3/TR; Case/Package: SOT-323(SC-70); Supplier-1: LCSC
R107 = RES_4.7K-0.1W-1%-0402: 4.7 kOhms ±1% 0.1W, 1/10W Chip Resistor 0402 (1005 Metric) Automotive AEC-Q200 Thick Film /; Manufacturer: Panasonic Electronic Components; Manufacturer Part Number: ERJ-2RKF4701X; Case/Package: 0402; Supplier-1: Digikey
R108 = RES_1K-0.1W-1%-0402: 1 kOhms ±1% 0.1W, 1/10W Chip Resistor 0402 (1005 Metric) Anti-Sulfur Thin Film /; Manufacturer: Vishay Beyschlag/Draloric/BC Components; Manufacturer Part Number: MCS04020C1001FE000; Case/Package: 0402; Supplier-1: Digikey
SW1-SW3 = SW1_4982: Tactile Switch 3x4x2mm SMD 2-Pin; Manufacturer: NA; Manufacturer Part Number: NA; Case/Package: SMD; Supplier-1: Sunrom

## Sheet [16]-SP1_TYPEC_PWR_IN.SchDoc: RK3399 SOM Board Design V1.0
size A4; Author: AVIRAL MISHRA; DocumentNumber: 18; SheetNumber: 18; SheetTotal: 21; PROJECT CODE: A_V1.0
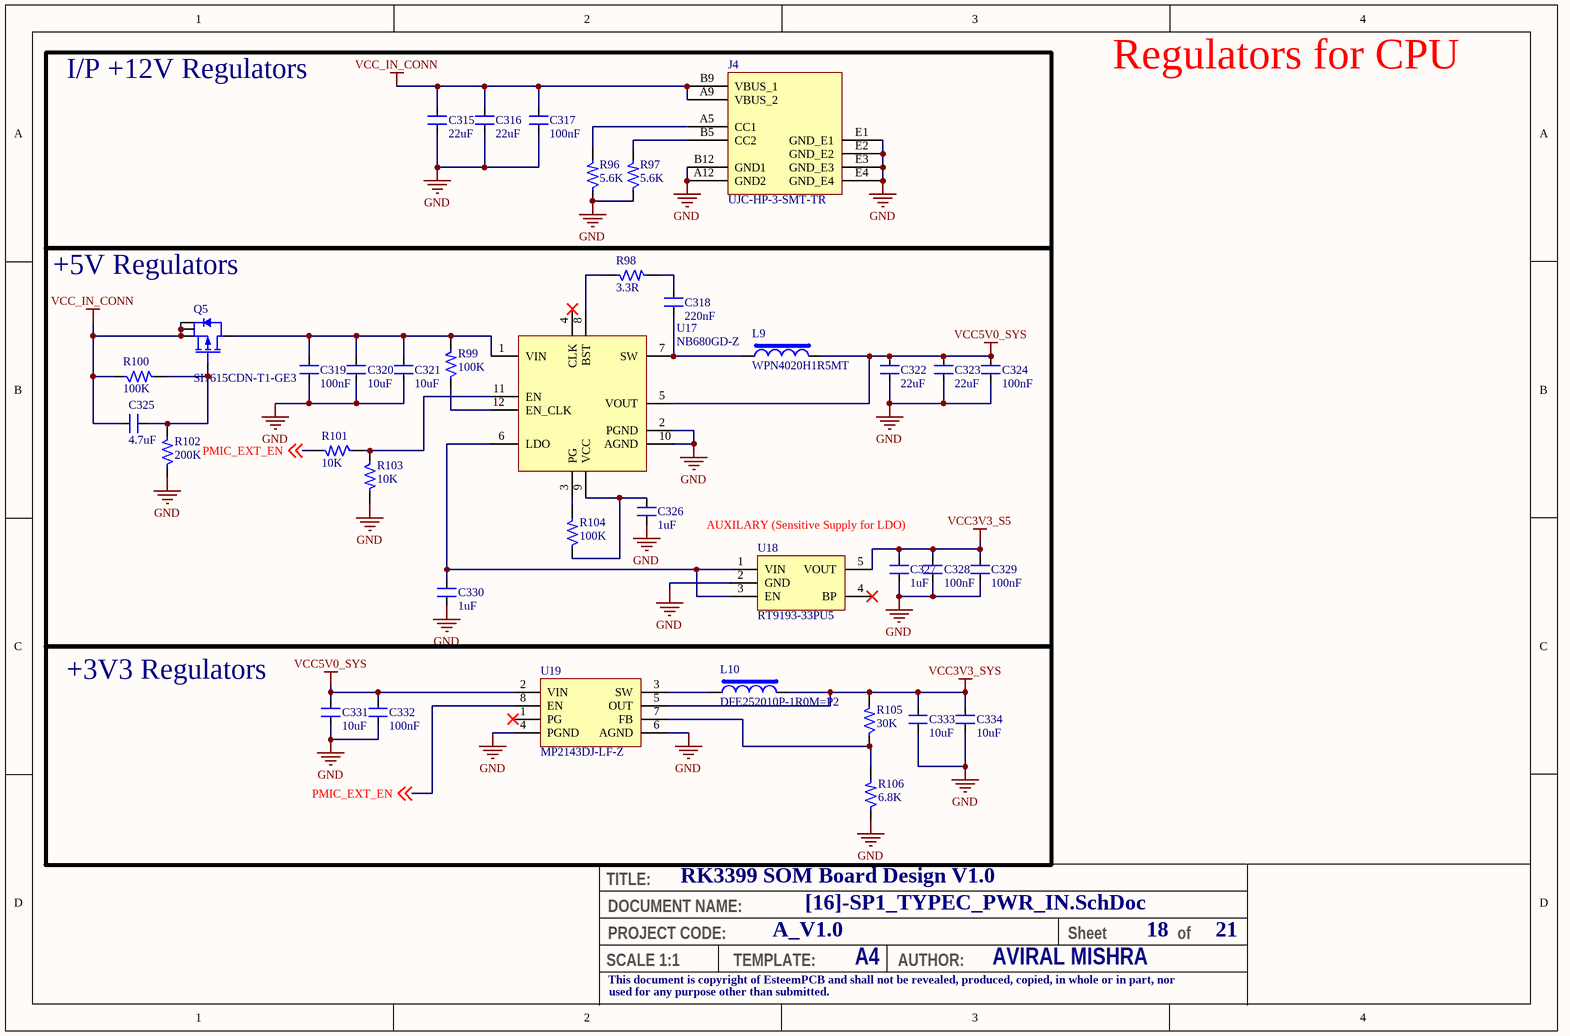
[diagram p17: [16]-SP1_TYPEC_PWR_IN.SchDoc]

### Parts
C315  22uF  [CAP_0603]
C316  22uF  [CAP_0603]
C317  100nF  [CAP_0402]
C318  220nF  [CAP_0402]
C319  100nF  [CAP_0402]
C320  10uF  [CAP_0402]
C321  10uF  [CAP_0402]
C322  22uF  [CAP_0603]
C323  22uF  [CAP_0603]
C324  100nF  [CAP_0402]
C325  4.7uF  [CAP_0402]
C326  1uF  [CAP_0402]
C327  1uF  [CAP_0402]
C328  100nF  [CAP_0402]
C329  100nF  [CAP_0402]
C330  1uF  [CAP_0402]
C331  10uF  [CAP_0402]
C332  100nF  [CAP_0402]
C333  10uF  [CAP_0402]
C334  10uF  [CAP_0402]
J4  UJC-HP-3-SMT-TR  [CON6_48.4_UJC-HP-3-SMT-TR]
L9  WPN4020H1R5MT  [IND_1616]
L10  DFE252010P-1R0M=P2  [IND_1008]
Q5  SI7615CDN-T1-GE3  [PowerPAK_1212-8_SMD]
R96  5.6K  [RES_0402]
R97  5.6K  [RES_0402]
R98  3.3R  [RES_0402]
R99  100K  [RES_0402]
R100  100K  [RES_0402]
R101  10K  [RES_0402]
R102  200K  [RES_0402]
R103  10K  [RES_0402]
R104  100K  [RES_0402]
R105  30K  [RES_0402]
R106  6.8K  [RES_0402]
U17  NB680GD-Z  [QFN-12_19_118X118_SMD]
U18  RT9193-33PU5  [SC70-5]
U19  MP2143DJ-LF-Z  [SOT23-8]

### Blocks framed on the sheet
I/P +12V Regulators: C315-C317 J4 R96 R97
+5V Regulators: C318-C330 L9 Q5 R98-R104 U17 U18
+3V3 Regulators: C331-C334 L10 R105 R106 U19

### Nets
GND: C315.1 C316.1 C317.1 C319.1 C320.1 C321.1 C322.1 C323.1 C324.1 C326.1 C327.1 C328.1 C329.1 C330.1 C331.1 C332.1 C333.1 C334.1 J4.A12(GND2) J4.B12(GND1) J4.E1(GND_E1) J4.E2(GND_E2) J4.E3(GND_E3) J4.E4(GND_E4) R96.1 R97.1 R102.1 R103.2 R106.1 U17.2(PGND) U17.10(AGND) U18.2(GND) U19.4(PGND) U19.6(AGND)
VCC3V3_S5: C327.2 C328.2 C329.2 U18.5(VOUT)
VCC3V3_SYS: C333.2 C334.2 L10.2 R105.2 U19.5(OUT)
VCC5V0_SYS: C322.2 C323.2 C324.2 C331.2 C332.2 L9.2 U17.5(VOUT) U19.2(VIN)
VCC_IN_CONN: C315.2 C316.2 C317.2 C325.1 J4.A9(VBUS_2) J4.B9(VBUS_1) Q5.1(S) Q5.2(S) Q5.3(S) R100.1
PMIC_EXT_EN: R101.2 U19.8(EN) ; off-sheet PMIC_EXT_EN
NetC318_1: C318.1 L9.1 U17.7(SW)
NetC318_2: C318.2 R98.2
NetC319_2: C319.2 C320.2 C321.2 Q5.5(D) R99.2 U17.1(VIN)
NetC325_2: C325.2 Q5.4(G) R100.2 R102.2
NetC326_2: C326.2 R104.1 U17.9(VCC)
NetC330_2: C330.2 U17.6(LDO) U18.1(VIN) U18.3(EN)
NetJ4_A5: J4.A5(CC1) R96.2
NetJ4_B5: J4.B5(CC2) R97.2
NetL10_1: L10.1 U19.3(SW)
NetR98_1: R98.1 U17.8(BST)
NetR99_1: R99.1 U17.12(EN_CLK)
NetR101_1: R101.1 R103.1 U17.11(EN)
NetR104_2: R104.2 U17.3(PG)
NetR105_1: R105.1 R106.2 U19.7(FB)

Not connected (* = marked no-connect by the designer): U17 4(CLK)*; U18 4(BP)*; U19 1(PG)*

### Notes on the sheet
- Regulators for CPU
- AUXILARY (Sensitive Supply for LDO)
- TITLE:
- DOCUMENT NAME:
- SCALE 1:1
- This document is copyright of EsteemPCB and shall not be revealed, produced, copied, in whole or in part, nor
- PROJECT CODE:
- TEMPLATE:
- A4
- AUTHOR:
- Sheet
- of
- used for any purpose other than submitted.

### Library data of the parts
C315 C316 C322 C323 = CAP_22uF-10V-20%-0603: 22µF ±20% 10V Ceramic Capacitor X5R 0603 (1608 Metric) /; Manufacturer: Murata Electronics; Manufacturer Part Number: GRM188R61A226ME15D; Case/Package: 0603; Supplier-1: Digikey
C317 C319 C324 C328 C329 C332 = CAP_100nF-25V-10%-0402: 0.1µF ±10% 25V Ceramic Capacitor X7R 0402 (1005 Metric) /; Manufacturer: Walsin Technology Corporation; Manufacturer Part Number: 0402B104K250CT; Case/Package: 0402; Supplier-1: Digikey
C318 = CAP_220nF-10V-10%-0402: 0.22µF ±10% 10V Ceramic Capacitor X7R 0402 (1005 Metric) /; Manufacturer: Samsung Electro-Mechanics; Manufacturer Part Number: CL05B224KP5NNNC; Case/Package: 0402; Supplier-1: Digikey
C320 C321 C331 C333 C334 = CAP_10uF-10V-20%-0402: as C351 on sheet [14]-RGMII_PHY; Case/Package: 0402; Supplier-1: Digikey
C325 = CAP_4.7uF-10V-10%-0402: 4.7µF ±10% 10V Ceramic Capacitor X5R 0402 (1005 Metric) /; Manufacturer: Samsung Electro-Mechanics; Manufacturer Part Number: CL05A475KP5NRNC; Case/Package: 0402; Supplier-1: Digikey
C326 C327 C330 = CAP_1uF-16V-10%-0402: 1µF ±10% 16V Ceramic Capacitor X5R 0402 (1005 Metric) /; Manufacturer: Knowles Novacap; Manufacturer Part Number: 0402BW105K160YT; Case/Package: 0402; Supplier-1: Digikey
J4 = CON-TYPEC_6X1-100-RA-TH: USB Connectors USB jack, C type, power only, 6 pin, horizonal, gold flash plating, surface mount, T&R; Manufacturer: CUI Devices; Manufacturer Part Number: UJC-HP-3-SMT-TR; Case/Package: TH; Supplier-1: Mouser
L9 = IND_1.5uH-6A-20%-SMD: Wire Wound SMD Power Inductors – WPN Series / Operating Temp. : -40℃~+125℃ (Including self-heating) /; Manufacturer: Sunlord; Mnaufcaturer Part Number: WPN4020H1R5MT; Case/Package: SMD; Supplier-1: NA
L10 = IND_1uH-3.8A-20%-1008: 1µH Shielded Wirewound Inductor 3.8A 54mOhm Max 1008 (2520 Metric) /; Manufacturer: Murata Electronics; Manufacturer Part Number: DFE252010P-1R0M=P2; Case/Package: 1008; Supplier-1: Digikey
Q5 = MOSFET-P_20V-35A-1212-8: P-Channel 20V 35A (Tc) 33W (Tc) Surface Mount PowerPAK® 1212-8 /; Manufacturer: Vishay Siliconix; Manufacturer Part Number: SI7615CDN-T1-GE3; Case/Package: PowerPAK® 1212-8; Supplier-1: Digikey
R96 R97 = RES_5.6K-0.1W-1%-0402: 5.6 kOhms ±1% 0.1W, 1/10W Chip Resistor 0402 (1005 Metric) Automotive AEC-Q200, Moisture Resistant Thick Film /; Manufacturer: KOA Speer Electronics, Inc.; Manufacturer Part Number: RK73H1ETTP5601F; Case/Package: 0402; Supplier-1: Digikey
R98 = RES_3.3R-0.1W-1%-0402: 3.3 Ohms ±1% 0.1W, 1/10W Chip Resistor 0402 (1005 Metric) Anti-Sulfur, Automotive AEC-Q200 Thick Film /; Manufacturer: Panasonic Electronic Components; Manufacturer Part Number: ERJ-U02F3R30X; Case/Package: 0402; Supplier-1: Digikey
R99 R100 R104 = RES_100K-0.1W-1%-0402: 100 kOhms ±1% 0.1W, 1/10W Chip Resistor 0402 (1005 Metric) Anti-Sulfur Thin Film /; Manufacturer: Vishay Beyschlag/Draloric/BC Components; Manufacturer Part Number: MCS04020C1003FE000; Case/Package: 0402; Supplier-1: Digikey
R101 R103 = RES_10K-0.1W-1%-0402: 10 kOhms ±1% 0.1W, 1/10W Chip Resistor 0402 (1005 Metric) Anti-Sulfur Thin Film /; Manufacturer: Vishay Beyschlag/Draloric/BC Components; Manufacturer Part Number: MCS04020C1002FE000; Case/Package: 0402; Supplier-1: Digikey
R102 = RES_200K-0.1W-1%-0402: 200 kOhms ±1% 0.1W, 1/10W Chip Resistor 0402 (1005 Metric) Automotive AEC-Q200 Thick Film /; Manufacturer: Panasonic Electronic Components; Manufacturer Part number: ERJ-2RKF2003X; Case/Package: 0402; Supplier-1: Digikey
R105 = RES_30K-0.1W-1%-0402: 30 kOhms ±1% 0.1W, 1/10W Chip Resistor 0402 (1005 Metric) Automotive AEC-Q200, Moisture Resistant Thick Film /; Manufacturer: KOA Speer Electronics, Inc.; Manufacturer Part Number: RK73H1ETTP3002F; Case/Package: 0402; Supplier-1: Digikey
R106 = RES_6.8K-0.1W-1%-0402: 6.8 kOhms ±1% 0.1W, 1/10W Chip Resistor 0402 (1005 Metric) Anti-Sulfur Thin Film /; Manufacturer Part Number: MCS04020C6801FE000; Manufacturer: Vishay Beyschlag/Draloric/BC Components; Case/Package: 0402; Supplier-1: Digikey
U17 = REG_3.3V-26V-8A-QFN-12: Switching Voltage Regulators 26V Fixed 3.3 V-8A Sync Buck Converter; Manufacturer: Monolithic Power Systems (MPS); Manufacturer Part Number: NB680GD-Z; Case/Package: QFN-12; Supplier-1: Mouser
U18 = REG_3.3V-5.5V-300mA-SC-70-5: SC-70-5 Dropout Regulators(LDO) RoHS; Manufacturer: Richtek Tech; Manufacturer Part Number: RT9193-33PU5; Case/Package: SC-70-5; Supplier-1: LCSC
U19 = REG_0.6~5V-5.5V-3A-TSOT-23-8: Switching Voltage Regulators 3A, 5.5V, 1.2MHz Sync Stp-Dwn Swtchr; Manufacturer: Monolithic Power Systems (MPS); Manufacturer Part Number: MP2143DJ-LF-Z; Case/Package: TSOT-23-8; Supplier-1: Mouser

## Sheet [17]-SP2_BUCKs_GPU_LOG_CPU-B.SchDoc: RK3399 SOM Board Design V1.0
size A3; Author: ABC; Organization: Altium Limited; Address1: L3, 12a Rodborough Rd; Address2: Frenchs Forest; Address3: NSW; Address4: Australia 2086; DocumentNumber: 19; SheetNumber: 19; SheetTotal: 21; PROJECT CODE: A_V1.0
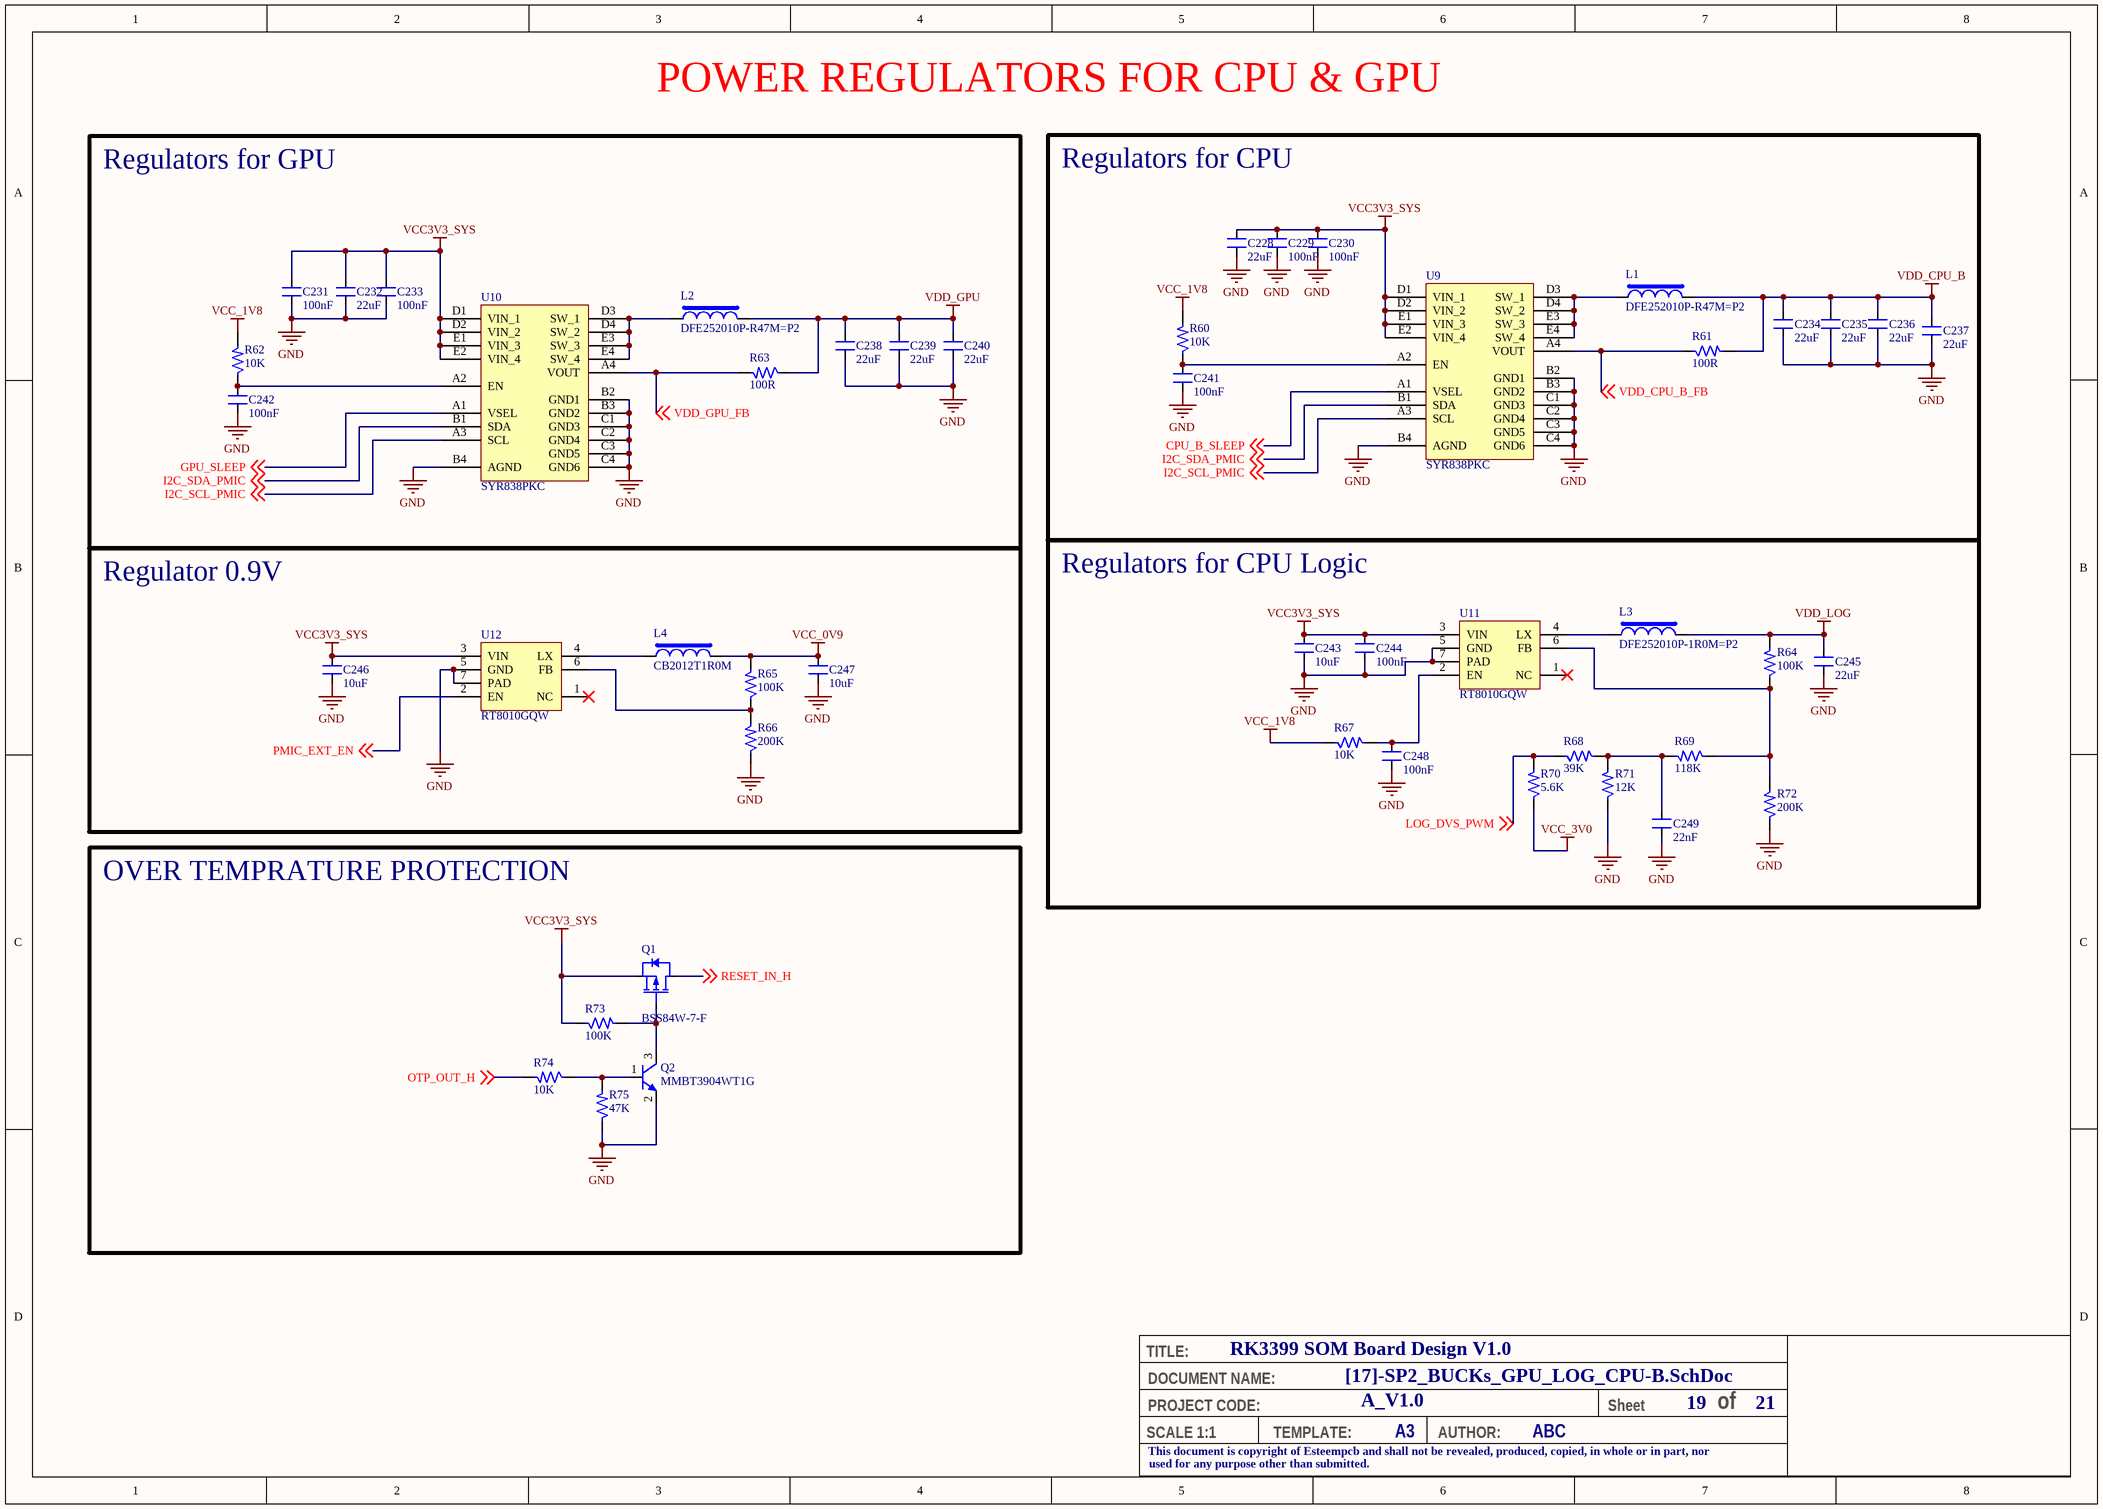
[diagram p18: [17]-SP2_BUCKs_GPU_LOG_CPU-B.SchDoc]

### Parts
C228  22uF  [CAP_0603]
C229  100nF  [CAP_0402]
C230  100nF  [CAP_0402]
C231  100nF  [CAP_0402]
C232  22uF  [CAP_0603]
C233  100nF  [CAP_0402]
C234  22uF  [CAP_0603]
C235  22uF  [CAP_0603]
C236  22uF  [CAP_0603]
C237  22uF  [CAP_0603]
C238  22uF  [CAP_0603]
C239  22uF  [CAP_0603]
C240  22uF  [CAP_0603]
C241  100nF  [CAP_0402]
C242  100nF  [CAP_0402]
C243  10uF  [CAP_0402]
C244  100nF  [CAP_0402]
C245  22uF  [CAP_0603]
C246  10uF  [CAP_0402]
C247  10uF  [CAP_0402]
C248  100nF  [CAP_0402]
C249  22nF  [CAP_0402]
L1  DFE252010P-R47M=P2  [IND_1008]
L2  DFE252010P-R47M=P2  [IND_1008]
L3  DFE252010P-1R0M=P2  [IND_1008]
L4  CB2012T1R0M  [IND_0805]
Q1  BSS84W-7-F  [SOT-323-3]
Q2  MMBT3904WT1G  [SOT-323-3]
R60  10K  [RES_0402]
R61  100R  [RES_0402]
R62  10K  [RES_0402]
R63  100R  [RES_0402]
R64  100K  [RES_0402]
R65  100K  [RES_0402]
R66  200K  [RES_0402]
R67  10K  [RES_0402]
R68  39K  [RES_0402]
R69  118K  [RES_0402]
R70  5.6K  [RES_0402]
R71  12K  [RES_0402]
R72  200K  [RES_0402]
R73  100K  [RES_0402]
R74  10K  [RES_0402]
R75  47K  [RES_0402]
U9  SYR838PKC  [CSP20_15.7_100x84_SMD]
U10  SYR838PKC  [CSP20_15.7_100x84_SMD]
U11  RT8010GQW  [WDFN-6_26_133X100_SMD]
U12  RT8010GQW  [WDFN-6_26_133X100_SMD]

### Blocks framed on the sheet
Regulators for GPU: C231-C233 C238-C240 C242 L2 R62 R63 U10
Regulators for CPU: C228-C230 C234-C237 C241 L1 R60 R61 U9
Regulator 0.9V: C246 C247 L4 R65 R66 U12
Regulators for CPU Logic: C243-C245 C248 C249 L3 R64 R67-R72 U11
OVER TEMPRATURE PROTECTION: Q1 Q2 R73-R75

### Nets
GND: C228.1 C229.1 C230.1 C231.1 C232.1 C233.1 C234.1 C235.1 C236.1 C237.1 C238.1 C239.1 C240.1 C241.1 C242.1 C243.1 C244.1 C245.1 C246.1 C247.1 C248.1 C249.1 Q2.2(E) R66.1 R71.1 R72.1 R75.1 U9.B2(GND1) U9.B3(GND2) U9.B4(AGND) U9.C1(GND3) U9.C2(GND4) U9.C3(GND5) U9.C4(GND6) U10.B2(GND1) U10.B3(GND2) U10.B4(AGND) U10.C1(GND3) U10.C2(GND4) U10.C3(GND5) U10.C4(GND6) U11.5(GND) U11.7(PAD) U12.5(GND) U12.7(PAD)
VCC3V3_SYS: C228.2 C229.2 C230.2 C231.2 C232.2 C233.2 C243.2 C244.2 C246.2 Q1.2(S) R73.1 U9.D1(VIN_1) U9.D2(VIN_2) U9.E1(VIN_3) U9.E2(VIN_4) U10.D1(VIN_1) U10.D2(VIN_2) U10.E1(VIN_3) U10.E2(VIN_4) U11.3(VIN) U12.3(VIN)
VCC_0V9: C247.2 L4.2 R65.2
VCC_1V8: R60.2 R62.2 R67.1
VCC_3V0: R70.1
VDD_CPU_B: C234.2 C235.2 C236.2 C237.2 L1.2 R61.2
VDD_GPU: C238.2 C239.2 C240.2 L2.2 R63.1
VDD_LOG: C245.2 L3.2 R64.2
CPU_B_SLEEP: U9.A1(VSEL) ; off-sheet CPU_B_SLEEP
GPU_SLEEP: U10.A1(VSEL) ; off-sheet GPU_SLEEP
I2C_SCL_PMIC: U9.A3(SCL) U10.A3(SCL) ; off-sheet I2C_SCL_PMIC
I2C_SDA_PMIC: U9.B1(SDA) U10.B1(SDA) ; off-sheet I2C_SDA_PMIC
LOG_DVS_PWM: R68.1 R70.2 ; off-sheet LOG_DVS_PWM
OTP_OUT_H: R74.2 ; off-sheet OTP_OUT_H
PMIC_EXT_EN: U12.2(EN) ; off-sheet PMIC_EXT_EN
RESET_IN_H: Q1.3(D) ; off-sheet RESET_IN_H
VDD_CPU_B_FB: R61.1 U9.A4(VOUT) ; off-sheet VDD_CPU_B_FB
VDD_GPU_FB: R63.2 U10.A4(VOUT) ; off-sheet VDD_GPU_FB
NetC241_2: C241.2 R60.1 U9.A2(EN)
NetC242_2: C242.2 R62.1 U10.A2(EN)
NetC248_2: C248.2 R67.2 U11.2(EN)
NetC249_2: C249.2 R68.2 R69.2 R71.2
NetL1_1: L1.1 U9.D3(SW_1) U9.D4(SW_2) U9.E3(SW_3) U9.E4(SW_4)
NetL2_1: L2.1 U10.D3(SW_1) U10.D4(SW_2) U10.E3(SW_3) U10.E4(SW_4)
NetL3_1: L3.1 U11.4(LX)
NetL4_1: L4.1 U12.4(LX)
NetQ1_1: Q1.1(G) Q2.3(C) R73.2
NetQ2_1: Q2.1(B) R74.1 R75.2
NetR64_1: R64.1 R69.1 R72.2 U11.6(FB)
NetR65_1: R65.1 R66.2 U12.6(FB)

Not connected (* = marked no-connect by the designer): U11 1(NC)*; U12 1(NC)*

### Notes on the sheet
- POWER REGULATORS FOR CPU & GPU
- TITLE:
- DOCUMENT NAME:
- SCALE 1:1
- This document is copyright of Esteempcb and shall not be revealed, produced, copied, in whole or in part, nor
- PROJECT CODE:
- TEMPLATE:
- A3
- AUTHOR:
- Sheet
- of
- used for any purpose other than submitted.

### Library data of the parts
C228 C232 C234-C240 C245 = CAP_22uF-10V-20%-0603: as C315 on sheet [16]-SP1_TYPEC_PWR_IN; Case/Package: 0603; Supplier-1: Digikey
C229-C231 C233 C241 C242 C244 C248 = CAP_100nF-25V-10%-0402: as C317 on sheet [16]-SP1_TYPEC_PWR_IN; Case/Package: 0402; Supplier-1: Digikey
C243 C246 C247 = CAP_10uF-10V-20%-0402: as C351 on sheet [14]-RGMII_PHY; Case/Package: 0402; Supplier-1: Digikey
C249 = CAP_22nF-10V-10%-0402: 0.022µF ±10% 10V Ceramic Capacitor X7R 0402 (1005 Metric) /; Manufacturer: Samsung Electro-Mechanics; Manufacturer Part Number: CL05B223KP5NNNC; Case/Package: 0402; Supplier-1: Digikey
L1 L2 = IND_470nH-5A-20%-1008: 470nH Shielded Wirewound Inductor 5A 35mOhm Max 1008 (2520 Metric); Manufacturer: Murata Electronics; Manufacturer Part Number: DFE252010P-R47M=P2; Case/Package: 1008; Supplier-1: Digikey
L3 = IND_1uH-3.8A-20%-1008: as L10 on sheet [16]-SP1_TYPEC_PWR_IN; Manufacturer Part Number: DFE252010P-1R0M=P2; Case/Package: 1008; Supplier-1: Digikey
L4 = IND_1uF-0.5A-20%-0805: 1uH ±20% 500mA 150mΩ 0805 Inductors (SMD) RoHS /; Manufacturer: Taiyo Yuden; Manufacturer Part Number: CB2012T1R0M; Case/Package: 0805; Supplier-1: LCSC
Q1 = MOSFET-P_50V-130mA-SOT-323: P-Channel 50V 130mA (Ta) 200mW (Ta) Surface Mount SOT-323; Manufacturer: Diodes Incorporated; Manufacturer Part Number: BSS84W-7-F; Case/Package: SOT-323; Supplier-1: Digikey
Q2 = TRNS-NPN_60V-0.2A-SOT323: Bipolar Transistors - BJT 200mA 60V NPN; Manufacturer: ON Semiconductor; Manufacturer Part Number: MMBT3904WT1G; Case/Package: SOT323; Supplier-1: Digikey
R60 R62 R67 R74 = RES_10K-0.1W-1%-0402: as R101 on sheet [16]-SP1_TYPEC_PWR_IN; Case/Package: 0402; Supplier-1: Digikey
R61 R63 = RES_100R-0.1W-1%-0402: 100 Ohms ±1% 0.1W, 1/10W Chip Resistor 0402 (1005 Metric) Automotive AEC-Q200, Moisture Resistant Thick Film /; Manufacturer: KOA Speer Electronics, Inc.; Manufacturer Part Number: RK73H1ETTP1000F; Case/Package: 0402; Supplier-1: Digikey
R64 R65 R73 = RES_100K-0.1W-1%-0402: as R99 on sheet [16]-SP1_TYPEC_PWR_IN; Case/Package: 0402; Supplier-1: Digikey
R66 R72 = RES_200K-0.1W-1%-0402: as R102 on sheet [16]-SP1_TYPEC_PWR_IN; Case/Package: 0402; Supplier-1: Digikey
R68 = RES_39K-0.1W-1%-0402: 39 kOhms ±1% 0.1W, 1/10W Chip Resistor 0402 (1005 Metric) Automotive AEC-Q200, Moisture Resistant Thick Film /; Manufacturer: KOA Speer Electronics, Inc.; Manufacturer Part Number: RK73H1ETTP3902F; Case/Package: 0402; Supplier-1: Digikey
R69 = RES_118K-0.1W-1%-0402: 118 kOhms ±1% 0.1W, 1/10W Chip Resistor 0402 (1005 Metric) Automotive AEC-Q200, Moisture Resistant Thick Film /; Manufacturer: KOA Speer Electronics, Inc.; Manuafcturer Part Number: RK73H1ETTP1183F; Case/Package: 0402; Supplier-1: Digikey
R70 = RES_5.6K-0.1W-1%-0402: as R96 on sheet [16]-SP1_TYPEC_PWR_IN; Case/Package: 0402; Supplier-1: Digikey
R71 = RES_12K-0.1W-1%-0402: 12 kOhms ±1% 0.1W, 1/10W Chip Resistor 0402 (1005 Metric) Anti-Sulfur Thin Film /; Manufacturer: Vishay Beyschlag/Draloric/BC Components; Manufacturer Part Number: MCS04020C1202FE000; Case/Package: 0402; Supplier-1: Digikey
R75 = RES_47K-0.1W-1%-0402: 47 kOhms ±1% 0.1W, 1/10W Chip Resistor 0402 (1005 Metric) Automotive AEC-Q200 Thick Film /; Manufacturer: Panasonic Electronic Components; Manufacturer Part Number: ERJ-2RKF4702X; Case/Package: 0402; Supplier-1: Digikey
U9 U10 = IC_SYR838PKC: Step-Down Positive Programmable 1 6A 2.4MHz CSP1.56*1.96-20 DC-DC Converters RoHS; Manufacturer: Silergy Corp; Manufacturer Part Number: SYR838PKC; Case/Package: CSP1.56*1.96-20; Supplier-1: LCSC
U11 U12 = REG-ADJ_5.5V-5.5V-1A-6-WDFN: Buck Switching Regulator IC Positive Adjustable 0.6V 1 Output 1A 6-WDFN Exposed Pad; Manufacturer: Richtek USA Inc.; Manufacturer Part Number: RT8010GQW; Case/Package: 6-WDFN; Supplier-1: Digikey

## Sheet [18]-SP3_PMIC_BLOCK.SchDoc: RK3399 SOM Board Design V1.0
size A3; Author: ABC; Organization: Altium Limited; Address1: L3, 12a Rodborough Rd; Address2: Frenchs Forest; Address3: NSW; Address4: Australia 2086; DocumentNumber: 20; SheetNumber: 20; SheetTotal: 21; PROJECT CODE: A_V1.0
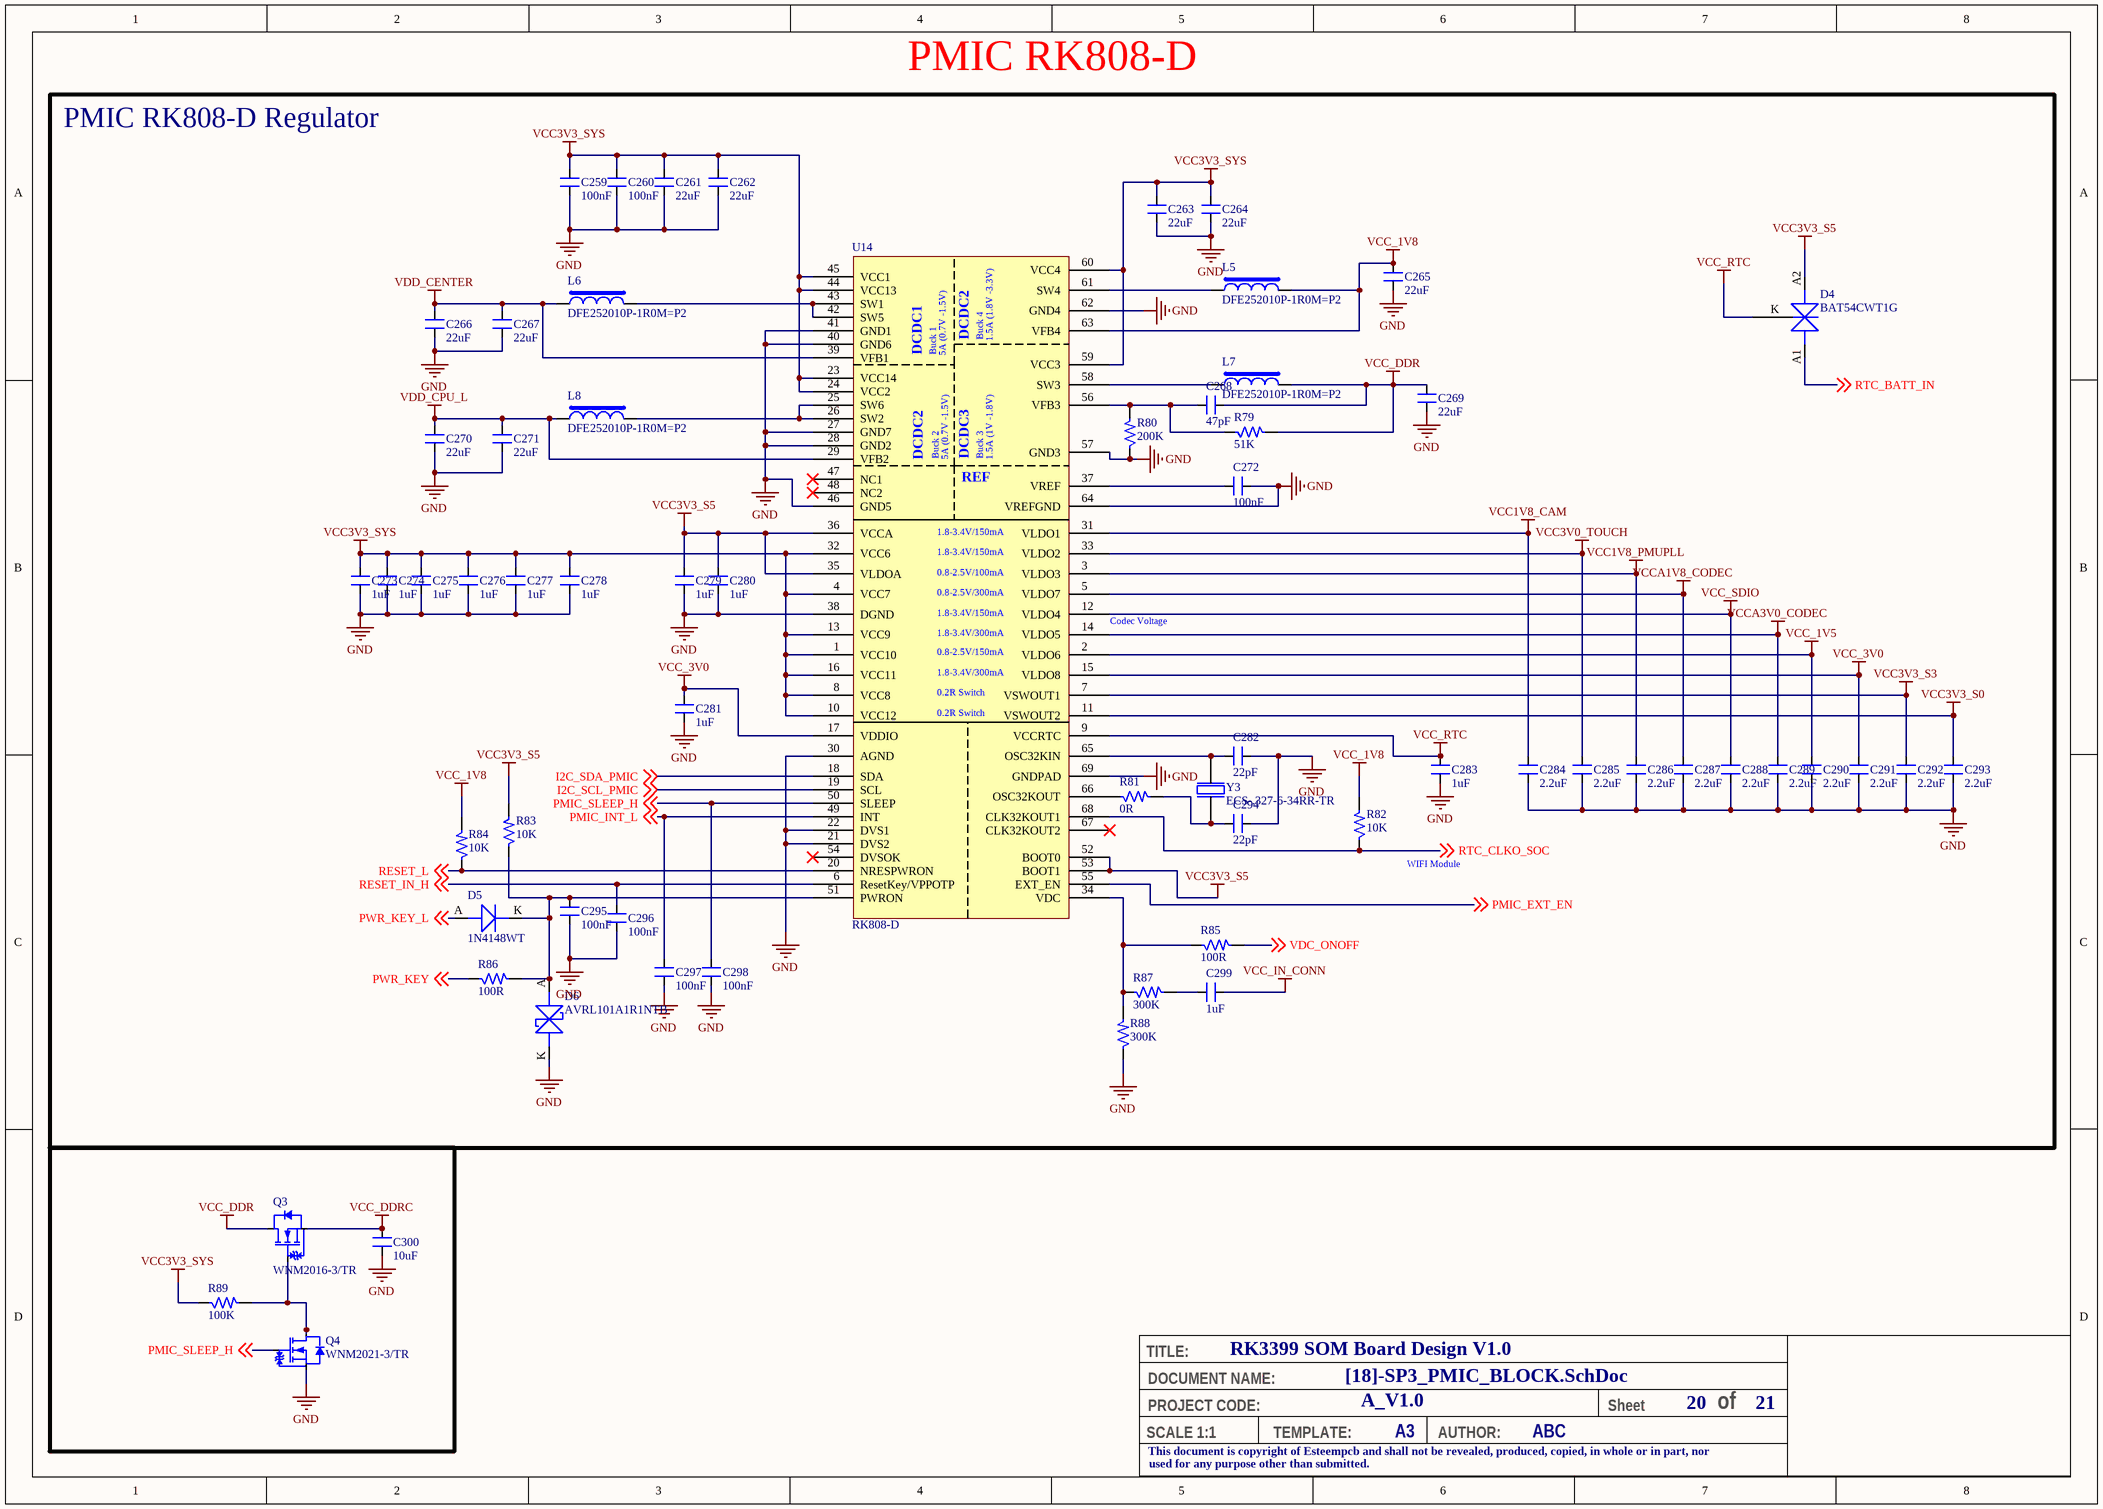
[diagram p19: [18]-SP3_PMIC_BLOCK.SchDoc]

### Parts
C259  100nF  [CAP_0402]
C260  100nF  [CAP_0402]
C261  22uF  [CAP_0603]
C262  22uF  [CAP_0603]
C263  22uF  [CAP_0603]
C264  22uF  [CAP_0603]
C265  22uF  [CAP_0603]
C266  22uF  [CAP_0603]
C267  22uF  [CAP_0603]
C268  47pF  [CAP_0402]
C269  22uF  [CAP_0603]
C270  22uF  [CAP_0603]
C271  22uF  [CAP_0603]
C272  100nF  [CAP_0402]
C273  1uF  [CAP_0402]
C274  1uF  [CAP_0402]
C275  1uF  [CAP_0402]
C276  1uF  [CAP_0402]
C277  1uF  [CAP_0402]
C278  1uF  [CAP_0402]
C279  1uF  [CAP_0402]
C280  1uF  [CAP_0402]
C281  1uF  [CAP_0402]
C282  22pF  [CAP_0402]
C283  1uF  [CAP_0402]
C284  2.2uF  [CAP_0402]
C285  2.2uF  [CAP_0402]
C286  2.2uF  [CAP_0402]
C287  2.2uF  [CAP_0402]
C288  2.2uF  [CAP_0402]
C289  2.2uF  [CAP_0402]
C290  2.2uF  [CAP_0402]
C291  2.2uF  [CAP_0402]
C292  2.2uF  [CAP_0402]
C293  2.2uF  [CAP_0402]
C294  22pF  [CAP_0402]
C295  100nF  [CAP_0402]
C296  100nF  [CAP_0402]
C297  100nF  [CAP_0402]
C298  100nF  [CAP_0402]
C299  1uF  [CAP_0402]
C300  10uF  [CAP_0402]
D4  BAT54CWT1G  [DIO_SOT-323-3]
D5  1N4148WT  [DIO_SOD523]
D6  AVRL101A1R1NTB  [DIO_0402_SMD]
L5  DFE252010P-1R0M=P2  [IND_1008]
L6  DFE252010P-1R0M=P2  [IND_1008]
L7  DFE252010P-1R0M=P2  [IND_1008]
L8  DFE252010P-1R0M=P2  [IND_1008]
Q3  WNM2016-3/TR  [SOT 23-3]
Q4  WNM2021-3/TR  [SOT-323-3]
R79  51K  [RES_0402]
R80  200K  [RES_0402]
R81  0R  [RES_0402]
R82  10K  [RES_0402]
R83  10K  [RES_0402]
R84  10K  [RES_0402]
R85  100R  [RES_0402]
R86  100R  [RES_0402]
R87  300K  [RES_0402]
R88  300K  [RES_0402]
R89  100K  [RES_0402]
U14  RK808-D  [QFN68_13.7_220.4X220.4_SMD]
Y3  ECS-.327-6-34RR-TR  [XTAL_ECS-.327-6-34RR-TR]

### Blocks framed on the sheet
PMIC RK808-D: C259-C299 D4-D6 L5-L8 R79-R88 U14 Y3

### Nets
GND: C259.1 C260.1 C261.1 C262.1 C263.1 C264.1 C265.1 C266.1 C267.1 C269.1 C270.1 C271.1 C272.1 C273.2 C274.1 C275.1 C276.1 C277.1 C278.1 C279.1 C280.1 C281.1 C282.2 C283.1 C284.1 C285.1 C286.1 C287.1 C288.1 C289.1 C290.1 C291.1 C292.1 C293.1 C294.2 C295.1 C296.1 C297.1 C298.1 C300.1 D6.K Q4.2(S) R80.1 R88.1 U14.21(DVS2) U14.22(DVS1) U14.27(GND7) U14.28(GND2) U14.30(AGND) U14.38(DGND) U14.40(GND6) U14.41(GND1) U14.46(GND5) U14.57(GND3) U14.62(GND4) U14.64(VREFGND) U14.69(GNDPAD)
VCC1V8_CAM: C284.2 U14.31(VLDO1)
VCC1V8_PMUPLL: C286.2 U14.3(VLDO3)
VCC3V0_TOUCH: C285.2 U14.33(VLDO2)
VCC3V3_S0: C293.2 U14.11(VSWOUT2)
VCC3V3_S3: C292.2 U14.7(VSWOUT1)
VCC3V3_S5: C279.2 C280.2 D4.A2 R83.2 U14.35(VLDOA) U14.36(VCCA) U14.52(BOOT0) U14.53(BOOT1)
VCC3V3_SYS: C259.2 C260.2 C261.2 C262.2 C263.2 C264.2 C273.1 C274.2 C275.2 C276.2 C277.2 C278.2 R89.1 U14.1(VCC10) U14.4(VCC7) U14.8(VCC8) U14.10(VCC12) U14.13(VCC9) U14.16(VCC11) U14.23(VCC14) U14.24(VCC2) U14.32(VCC6) U14.44(VCC13) U14.45(VCC1) U14.59(VCC3) U14.60(VCC4)
VCC_1V5: C290.2 U14.2(VLDO6)
VCC_1V8: C265.2 L5.2 R82.2 R84.2 U14.63(VFB4)
VCC_3V0: C281.2 C291.2 U14.15(VLDO8) U14.17(VDDIO)
VCC_DDR: C268.2 C269.2 L7.2 Q3.3(D) R79.2
VCC_DDRC: C300.2 Q3.2(S)
VCC_IN_CONN: C299.1
VCC_RTC: C283.2 D4.K U14.9(VCCRTC)
VCC_SDIO: C288.2 U14.12(VLDO4)
VCCA1V8_CODEC: C287.2 U14.5(VLDO7)
VCCA3V0_CODEC: C289.2 U14.14(VLDO5)
VDD_CENTER: C266.2 C267.2 L6.1 U14.39(VFB1)
VDD_CPU_L: C270.2 C271.2 L8.1 U14.29(VFB2)
I2C_SCL_PMIC: U14.19(SCL) ; off-sheet I2C_SCL_PMIC
I2C_SDA_PMIC: U14.18(SDA) ; off-sheet I2C_SDA_PMIC
PMIC_EXT_EN: U14.55(EXT_EN) ; off-sheet PMIC_EXT_EN
PMIC_INT_L: C297.2 U14.49(INT) ; off-sheet PMIC_INT_L
PMIC_SLEEP_H: C298.2 Q4.1(G) U14.50(SLEEP) ; off-sheet PMIC_SLEEP_H
PWR_KEY: R86.1 ; off-sheet PWR_KEY
PWR_KEY_L: D5.A(ANODE) ; off-sheet PWR_KEY_L
RESET_IN_H: C296.2 U14.6(ResetKey/VPPOTP) ; off-sheet RESET_IN_H
RESET_L: R84.1 U14.20(NRESPWRON) ; off-sheet RESET_L
RTC_BATT_IN: D4.A1 ; off-sheet RTC_BATT_IN
RTC_CLKO_SOC: R82.1 U14.68(CLK32KOUT1) ; off-sheet RTC_CLKO_SOC
VDC_ONOFF: R85.2 ; off-sheet VDC_ONOFF
NetC268_1: C268.1 R79.1 R80.2 U14.56(VFB3)
NetC272_2: C272.2 U14.37(VREF)
NetC282_1: C282.1 U14.65(OSC32KIN) Y3.2
NetC294_1: C294.1 R81.2 Y3.1
NetC295_2: C295.2 D5.K(CATHODE) D6.A R83.1 R86.2 U14.51(PWRON)
NetC299_2: C299.2 R87.2
NetL5_1: L5.1 U14.61(SW4)
NetL6_2: L6.2 U14.42(SW5) U14.43(SW1)
NetL7_1: L7.1 U14.58(SW3)
NetL8_2: L8.2 U14.25(SW6) U14.26(SW2)
NetQ3_1: Q3.1(G) Q4.3(D) R89.2
NetR81_1: R81.1 U14.66(OSC32KOUT)
NetR85_1: R85.1 R87.1 R88.2 U14.34(VDC)

Not connected (* = marked no-connect by the designer): U14 47(NC1)* 48(NC2)* 54(DVSOK)* 67(CLK32KOUT2)*

### Notes on the sheet
- PMIC RK808-D Regulator
- (near U14) Codec Voltage
- (near R82) WIFI Module
- TITLE:
- DOCUMENT NAME:
- SCALE 1:1
- This document is copyright of Esteempcb and shall not be revealed, produced, copied, in whole or in part, nor
- PROJECT CODE:
- TEMPLATE:
- A3
- AUTHOR:
- Sheet
- of
- used for any purpose other than submitted.
- (in symbol IC_RK808-D-QFN68) DCDC2; Buck 4; 1.5A (1.8V -3.3V); DCDC1; Buck 1; 5A (0.7V -1.5V); Buck 2; DCDC3; Buck 3; 1.5A (1V -1.8V); REF; 1.8-3.4V/150mA; 0.8-2.5V/100mA; 0.8-2.5V/300mA; 1.8-3.4V/300mA; 0.8-2.5V/150mA; 0.2R Switch

### Library data of the parts
C259 C260 C272 C295-C298 = CAP_100nF-25V-10%-0402: as C317 on sheet [16]-SP1_TYPEC_PWR_IN; Case/Package: 0402; Supplier-1: Digikey
C261-C267 C269-C271 = CAP_22uF-10V-20%-0603: as C315 on sheet [16]-SP1_TYPEC_PWR_IN; Case/Package: 0603; Supplier-1: Digikey
C268 = CAP_47pF-10V-10%-0402: 47pF ±10% 10V Ceramic Capacitor C0G, NP0 0402 (1005 Metric) /; Manufacturer: KEMET; Manufacturer Part Number: C0402C470K8GAC7867; Case/Package: 0402; Supplier-1: Supplier-1
C273-C281 C283 C299 = CAP_1uF-16V-10%-0402: as C326 on sheet [16]-SP1_TYPEC_PWR_IN; Case/Package: 0402; Supplier-1: Digikey
C282 C294 = CAP_22pF-10V-10%-0402: 22pF ±10% 10V Ceramic Capacitor C0G, NP0 0402 (1005 Metric) /; Manufacturer: KEMET; Manufacturer Part Number: C0402C220K8GACTU; Case/Package: 0402; Supplier-1: Digikey
C284-C293 = CAP_2.2uF-10V-10%-0402: 2.2µF ±10% 10V Ceramic Capacitor X5R 0402 (1005 Metric) /; Manufacturer: Murata Electronics; Manufacturer Part Number: GRM155R61A225KE95D; Case/Package: 0402; Supplier-1: Digikey
C300 = CAP_10uF-10V-20%-0402: as C351 on sheet [14]-RGMII_PHY; Case/Package: 0402; Supplier-1: Digikey
D4 = DIO-S-A_30V-200mA-SOT-323: Diode Array 1 Pair Common Cathode Schottky 30V 200mA (DC) Surface Mount SC-70, SOT-323; Manufacturer: ON Semiconductor; Manufacturer Part Number: BAT54CWT1G; Case/Package: SOT323; Supplier-1: Digikey
D5 = DIO_75V-200mA-SOD-523F: Diode Standard 100V 300mA (DC) Surface Mount SOD-123; Manufacturer: FAIRCHILD; Manufacturer Part Number: 1N4148WT; Case/Package: SOD123; Supplier-1: SIRICOM
D6 = DIO-T_10V-39V-0402: 39V Varistor 1 Circuit Surface Mount, MLCV 0402 (1005 Metric); Manufacturer: TDK Corporation; Manufacturer Part Number: AVRL101A1R1NTB; Supplier-1: Digikey; Case/Package: 0402
L5-L8 = IND_1uH-3.8A-20%-1008: as L10 on sheet [16]-SP1_TYPEC_PWR_IN; Manufacturer Part Number: DFE252010P-1R0M=P2; Case/Package: 1008; Supplier-1: Digikey
Q3 = MOSFET-N_20V-2.9A-SOT-23: N Channel 20V 2.9A 1V @ 250uA 47mΩ @ 3.6A,4.5V 700mW SOT-23(SOT-23-3) MOSFET RoHS /; Manufacturer: WILLSEMI(Will Semicon); Manufacturer Part Number: WNM2016-3/TR; Case/Package: SOT-23(SOT-23-3); Supplier-1: LCSC
Q4 = MOSFET-N_20V-820mA-SOT-323: as Q6 on sheet [15]-Push_Button_&_SYS_LED; Manufacturer Part Number: WNM2021-3/TR; Case/Package: SOT-323(SC-70); Supplier-1: LCSC
R79 = RES_51K-0.1W-1%-0402: 51 kOhms ±1% 0.1W, 1/10W Chip Resistor 0402 (1005 Metric) Automotive AEC-Q200 Thick Film /; Manufacturer: Panasonic Electronic Components; Manufacturer Part Number: ERJ-2RKF5102X; Case/Package: 0402; Supplier-1: Digikey
R80 = RES_200K-0.1W-1%-0402: as R102 on sheet [16]-SP1_TYPEC_PWR_IN; Case/Package: 0402; Supplier-1: Digikey
R81 = RES_0R-0.1W-1%-0402: 0 Ohms Jumper 0.1W, 1/10W Chip Resistor 0402 (1005 Metric) Automotive AEC-Q200 Thick Film; Manufacturer: Panasonic Electronic Components; Manufacturer Part Number: ERJ-2GE0R00X; Case/Package: 0402; Supplier-1: Digikey
R82-R84 = RES_10K-0.1W-1%-0402: as R101 on sheet [16]-SP1_TYPEC_PWR_IN; Case/Package: 0402; Supplier-1: Digikey
R85 R86 = RES_100R-0.1W-1%-0402: as R61 on sheet [17]-SP2_BUCKs_GPU_LOG_CPU-B; Case/Package: 0402; Supplier-1: Digikey
R87 R88 = RES_300K-0.1W-1%-0402: 300 kOhms ±1% 0.1W, 1/10W Chip Resistor 0402 (1005 Metric) Automotive AEC-Q200 Thick Film /; Manufacturer: Panasonic Electronic Components; Manufacturer Part Number: ERJ-2RKF3003X; Case/Package: 0402; Supplier-1: Digikey
R89 = RES_100K-0.1W-1%-0402: as R99 on sheet [16]-SP1_TYPEC_PWR_IN; Case/Package: 0402; Supplier-1: Digikey
U14 = IC_RK808-D-QFN68: The RK808 is a complete power supply solution for Portable systems.; Manufacturer: Rockchip; Manufacturer Part Number: RK808-D; Case/Package: QFN68; Supplier-1: Rockchip
Y3 = XTAL_32.768Khz-22pF-SMD: 32.768kHz ±20ppm Crystal 12pF 80 kOhms 2-SMD, No Lead /; Manufacturer: Ecliptek; Manufacturer Part Number: ECS-.327-6-34RR-TR; Case/Package: 0603; Supplier-1: Digikey